# EAGLE design GhelbereuEduardGabrielPROIECT2026 (EAGLE 9.7.0)
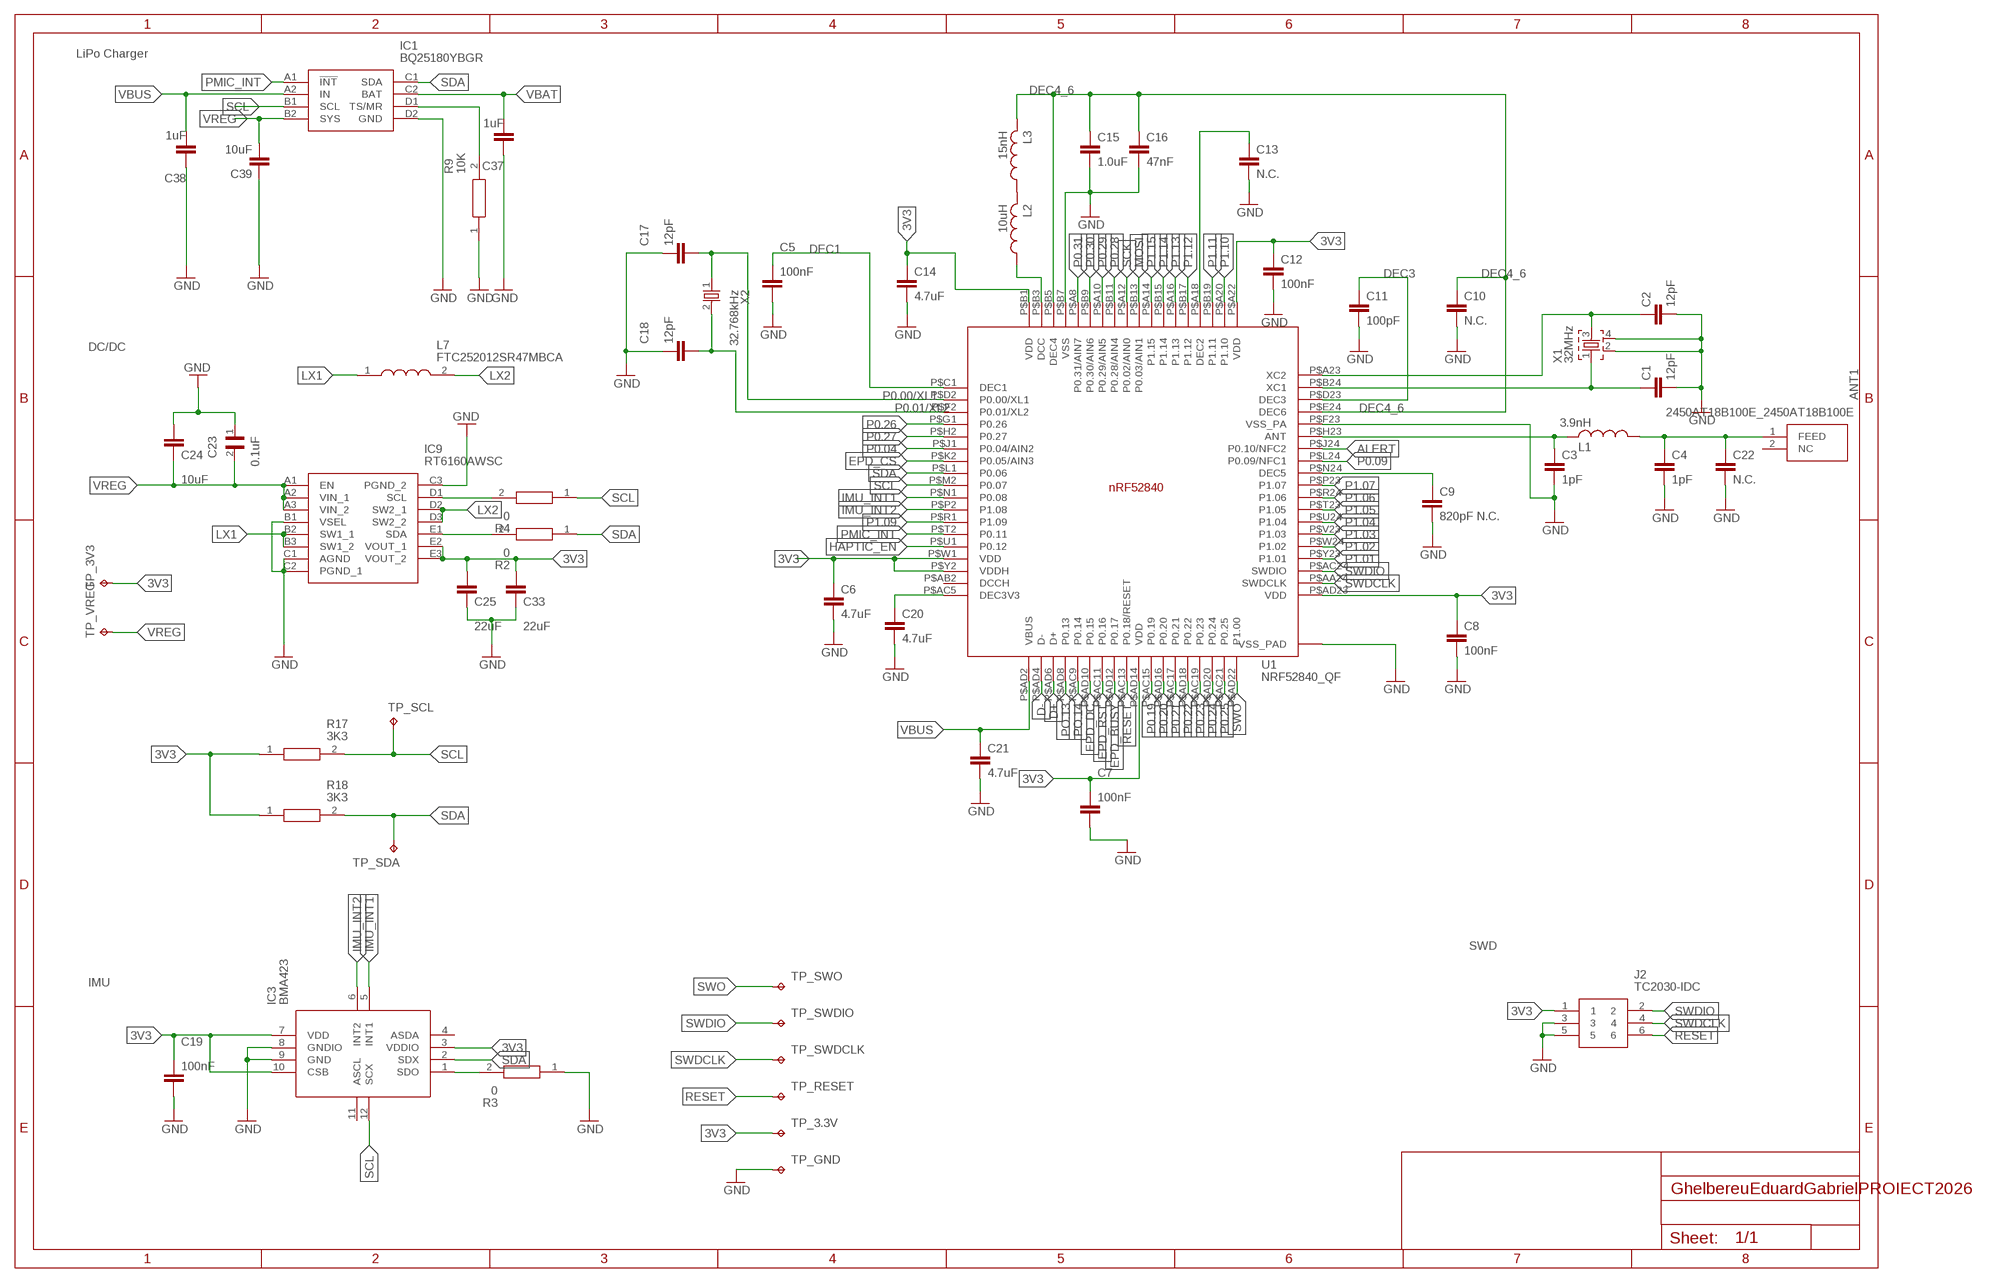
[diagram p0: schematic, sheet 1, part 1 of 2]
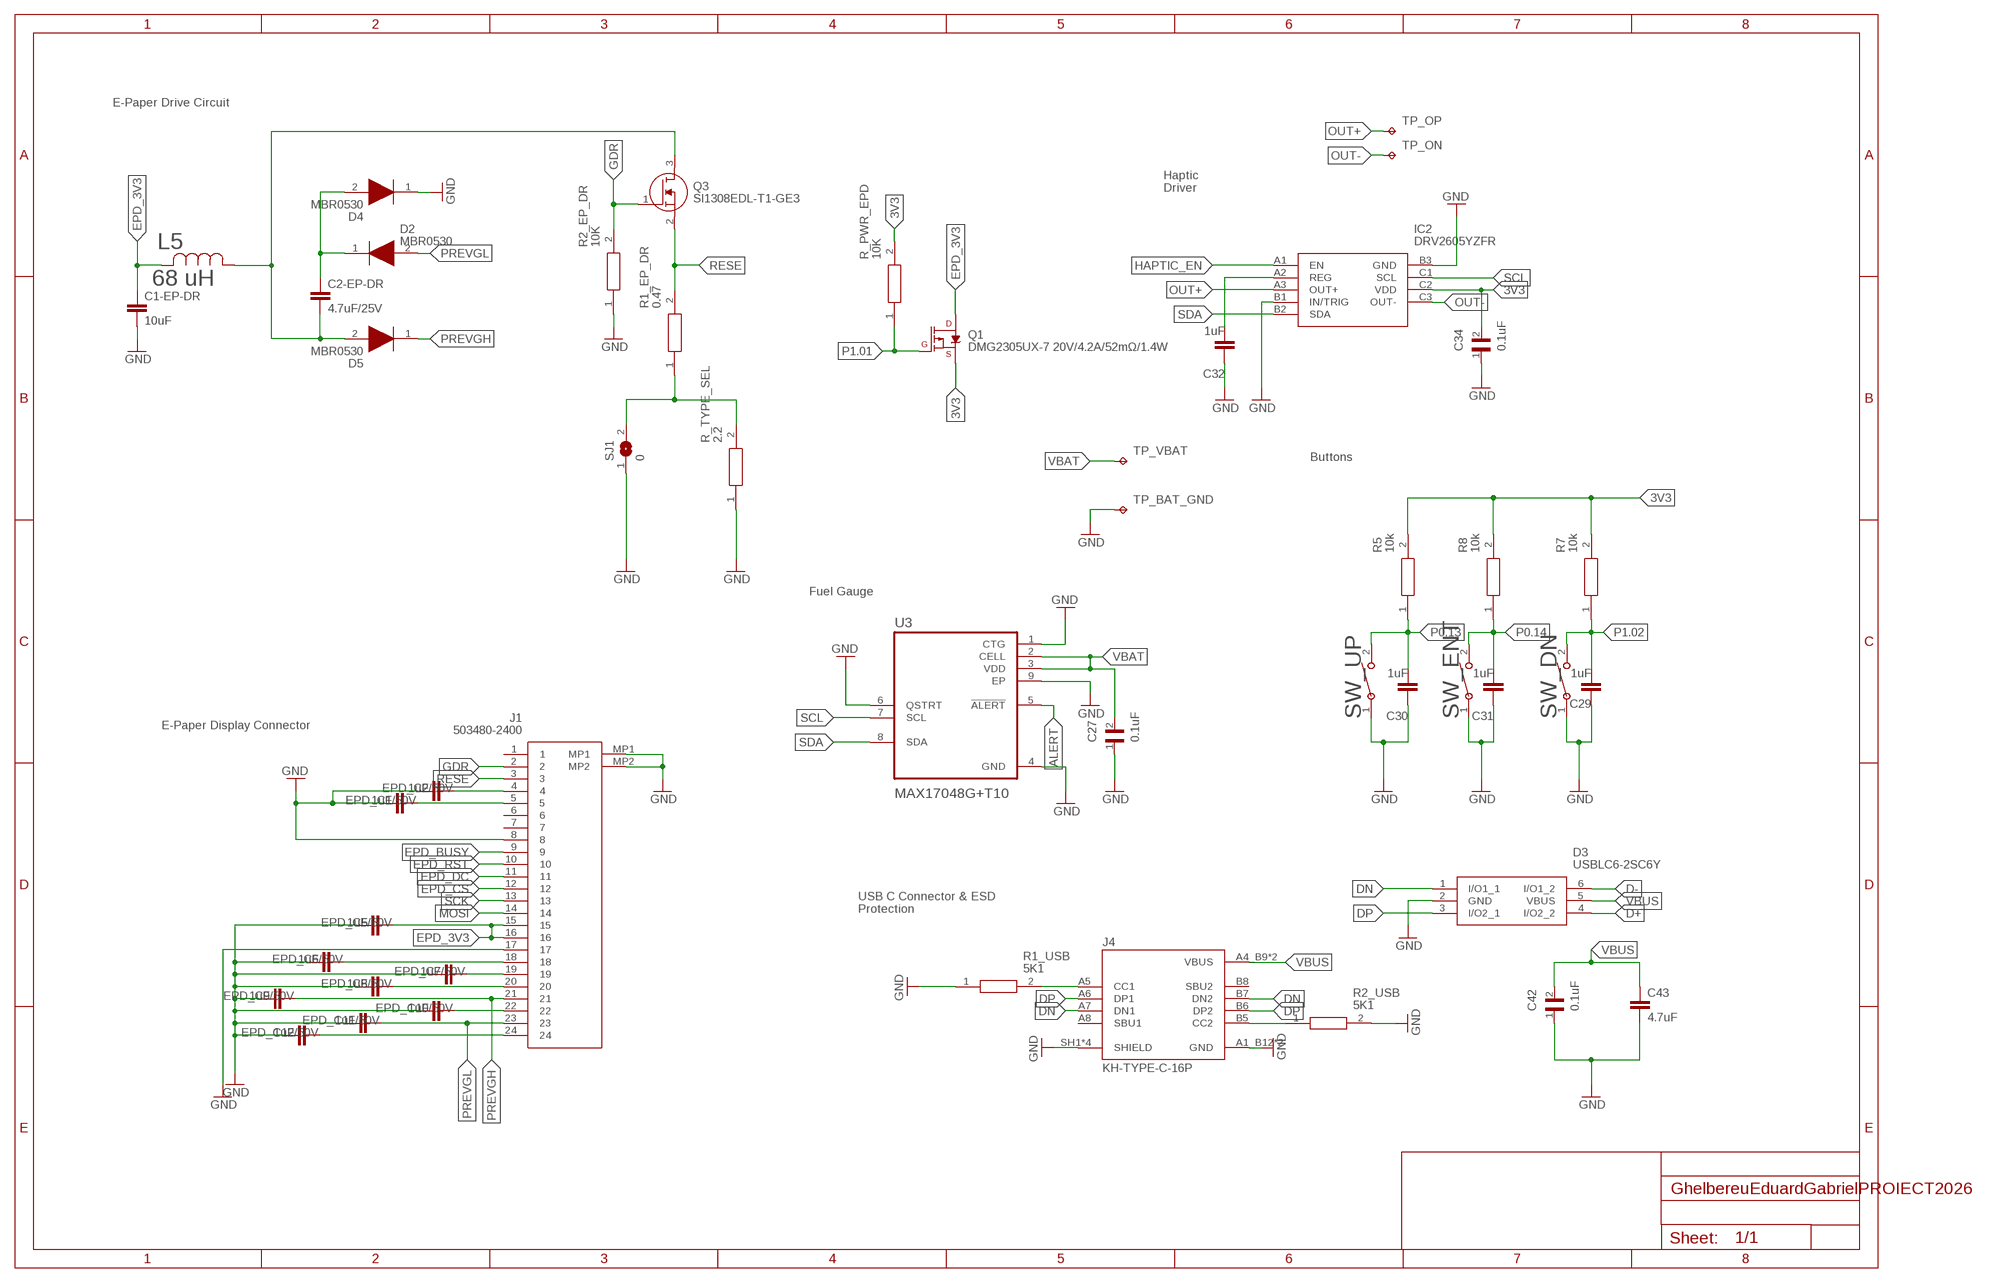
[diagram p1: schematic, sheet 1, part 2 of 2]

## Parts
ANT1  2450AT18B100E_2450AT18B100E  [2450AT18B100E_ANTC3216X140N]
C1  12pF  NORDIC_NRF_3_CAPACITOR_0201_L  [NORDIC_NRF_3_RESC0201_L]
C1-EP-DR  10uF  PERFECT_0402_CAP_0402  [PERFECT_0402_0402]
C2  12pF  NORDIC_NRF_3_CAPACITOR_0201_L  [NORDIC_NRF_3_RESC0201_L]
C2-EP-DR  4.7uF/25V  PERFECT_0402_CAP_0402  [PERFECT_0402_0402]
C3  1pF  NORDIC_NRF_3_CAPACITOR_0201_L  [NORDIC_NRF_3_RESC0201_L]
C4  1pF  NORDIC_NRF_3_CAPACITOR_0201_L  [NORDIC_NRF_3_RESC0201_L]
C5  100nF  NORDIC_NRF_3_CAPACITOR_0201_L  [NORDIC_NRF_3_RESC0201_L]
C6  4.7uF  PERFECT_0402_CAP_0402  [PERFECT_0402_0402]
C7  100nF  NORDIC_NRF_3_CAPACITOR_0201_L  [NORDIC_NRF_3_RESC0201_L]
C8  100nF  NORDIC_NRF_3_CAPACITOR_0201_L  [NORDIC_NRF_3_RESC0201_L]
C9  820pF N.C.  NORDIC_NRF_3_CAPACITOR_0201_L  [NORDIC_NRF_3_RESC0201_L]
C10  N.C.  NORDIC_NRF_3_CAPACITOR_0201_L  [NORDIC_NRF_3_RESC0201_L]
C11  100pF  NORDIC_NRF_3_CAPACITOR_0201_L  [NORDIC_NRF_3_RESC0201_L]
C12  100nF  NORDIC_NRF_3_CAPACITOR_0201_L  [NORDIC_NRF_3_RESC0201_L]
C13  N.C.  NORDIC_NRF_3_CAPACITOR_0201_L  [NORDIC_NRF_3_RESC0201_L]
C14  4.7uF  PERFECT_0402_CAP_0402  [PERFECT_0402_0402]
C15  1.0uF  PERFECT_0402_CAP_0402  [PERFECT_0402_0402]
C16  47nF  NORDIC_NRF_3_CAPACITOR_0201_L  [NORDIC_NRF_3_RESC0201_L]
C17  12pF  NORDIC_NRF_3_CAPACITOR_0201_L  [NORDIC_NRF_3_RESC0201_L]
C18  12pF  NORDIC_NRF_3_CAPACITOR_0201_L  [NORDIC_NRF_3_RESC0201_L]
C19  100nF  NORDIC_NRF_3_CAPACITOR_0201_L  [NORDIC_NRF_3_RESC0201_L]
C20  4.7uF  PERFECT_0402_CAP_0402  [PERFECT_0402_0402]
C21  4.7uF  PERFECT_0402_CAP_0402  [PERFECT_0402_0402]
C22  N.C.  NORDIC_NRF_3_CAPACITOR_0201_L  [NORDIC_NRF_3_RESC0201_L]
C23  0.1uF  GRM011R60J152KE01L_1_GRM011R60J152KE01L  [GRM011R60J152KE01L_1_0201]
C24  10uF  PERFECT_0402_CAP_0402  [PERFECT_0402_0402]
C25  22uF  PERFECT_0402_CAP_0402  [PERFECT_0402_0402]
C27  0.1uF  GRM011R60J152KE01L_2_GRM011R60J152KE01L  [GRM011R60J152KE01L_2_CAPC0201X13N]
C29  1uF  NORDIC_NRF_3_CAPACITOR_0402_L  [NORDIC_NRF_3_RESC0402_L]
C30  1uF  NORDIC_NRF_3_CAPACITOR_0402_L  [NORDIC_NRF_3_RESC0402_L]
C31  1uF  NORDIC_NRF_3_CAPACITOR_0402_L  [NORDIC_NRF_3_RESC0402_L]
C32  1uF  NORDIC_NRF_3_CAPACITOR_0402_L  [NORDIC_NRF_3_RESC0402_L]
C33  22uF  PERFECT_0402_CAP_0402  [PERFECT_0402_0402]
C34  0.1uF  GRM011R60J152KE01L_2_GRM011R60J152KE01L  [GRM011R60J152KE01L_2_CAPC0201X13N]
C37  1uF  NORDIC_NRF_3_CAPACITOR_0402_L  [NORDIC_NRF_3_RESC0402_L]
C38  1uF  NORDIC_NRF_3_CAPACITOR_0402_L  [NORDIC_NRF_3_RESC0402_L]
C39  10uF  NORDIC_NRF_3_CAPACITOR_0402_L  [NORDIC_NRF_3_RESC0402_L]
C42  0.1uF  GRM011R60J152KE01L_2_GRM011R60J152KE01L  [GRM011R60J152KE01L_2_CAPC0201X13N]
C43  4.7uF  PERFECT_0402_CAP_0402  [PERFECT_0402_0402]
D2  MBR0530  ESP32_C6_LIBRARY_5_MBR0530  [ESP32_C6_LIBRARY_5_SOD3716X135N]
D3  USBLC6-2SC6Y  ESP32_C6_LIBRARY_3_USBLC6-2SC6Y  [ESP32_C6_LIBRARY_3_SOT95P280X145-6N]
D4  MBR0530  ESP32_C6_LIBRARY_5_MBR0530  [ESP32_C6_LIBRARY_5_SOD3716X135N]
D5  MBR0530  ESP32_C6_LIBRARY_5_MBR0530  [ESP32_C6_LIBRARY_5_SOD3716X135N]
EPD_C1  1uF/50V  PERFECT_0402_CAP_0402  [PERFECT_0402_0402]
EPD_C2  1uF/50V  PERFECT_0402_CAP_0402  [PERFECT_0402_0402]
EPD_C5  1uF/50V  PERFECT_0402_CAP_0402  [PERFECT_0402_0402]
EPD_C6  1uF/50V  PERFECT_0402_CAP_0402  [PERFECT_0402_0402]
EPD_C7  1uF/50V  PERFECT_0402_CAP_0402  [PERFECT_0402_0402]
EPD_C8  1uF/50V  PERFECT_0402_CAP_0402  [PERFECT_0402_0402]
EPD_C9  1uF/50V  PERFECT_0402_CAP_0402  [PERFECT_0402_0402]
EPD_C10  1uF/50V  PERFECT_0402_CAP_0402  [PERFECT_0402_0402]
EPD_C11  1uF/50V  PERFECT_0402_CAP_0402  [PERFECT_0402_0402]
EPD_C12  1uF/50V  PERFECT_0402_CAP_0402  [PERFECT_0402_0402]
IC1  BQ25180YBGR  BQ25180YBGR_BQ25180YBGR  [BQ25180YBGR_BGA8C40P2X4_100X155X50]
IC2  DRV2605YZFR  DRV2605YZFR_DRV2605YZFR  [DRV2605YZFR_BGA9C50P3X3_144X144X62]
IC3  BMA423  BMA423_BMA423  [BMA423_BMA423]
IC9  RT6160AWSC  RT6160AWSC_RT6160AWSC  [RT6160AWSC_BGA15C40P3X5_140X230X60]
J1  503480-2400  503480-2400_503480-2400  [503480-2400_5034802400]
J2  TC2030-IDC  TC2030-IDC_TC2030-IDC  [TC2030-IDC_TC2030IDC]
J4  KH-TYPE-C-16P  KH-TYPE-C-16P_KH-TYPE-C-16P  [KH-TYPE-C-16P_KINGHELM_KH-TYPE-C-16P]
L1  3.9nH  NORDIC_NRF_2_INDUCTOR_0402_L  [NORDIC_NRF_2_RESC0402_L]
L2  10uH  NORDIC_NRF_2_INDUCTOR_0402_L  [NORDIC_NRF_2_RESC0402_L]
L3  15nH  NORDIC_NRF_2_INDUCTOR_0402_L  [NORDIC_NRF_2_RESC0402_L]
L5  68 uH  ESP32_C6_LIBRARY_2_744043680IND_4828-WE-TPC_WRE  [ESP32_C6_LIBRARY_2_IND_4828-WE-TPC_WRE]
L7  FTC252012SR47MBCA  MLP2016SR47MT0S1_FTC252012SR47MBCA  [MLP2016SR47MT0S1_INDC2016X100N]
Q1  DMG2305UX-7 20V/4.2A/52mΩ/1.4W  ESP32_C6_LIBRARY_4_ESP32_WROVER_SPARKFUN-DISCRETESEMI_MOSFET_PCH-DMG2305UX-7  [ESP32_C6_LIBRARY_4_ESP32_C6_LIBRARY_4_ESP32_C6_LIBRARY_4_ESP32_C6_LIBRARY_4_ESP32_WROVER_SPARKFUN-DISCRETESEMI_SOT23-3]
Q3  SI1308EDL-T1-GE3  ESP32_C6_LIBRARY_6_SI1308EDL-T1-GE3  [ESP32_C6_LIBRARY_6_SOT65P210X110-3N]
R1_EP_DR  0.47  ERA-1AEB3401C_CPF0201D7K68C1  [ERA-1AEB3401C_0201]
R1_USB  5K1  CPF0201D7K68C1_CPF0201D7K68C1  [CPF0201D7K68C1_0201]
R2  0  ERA-1AEB3401C_CPF0201D7K68C1  [ERA-1AEB3401C_0201]
R2_EP_DR  10K  ERA-1AEB3401C_CPF0201D7K68C1  [ERA-1AEB3401C_0201]
R2_USB  5K1  CPF0201D7K68C1_CPF0201D7K68C1  [CPF0201D7K68C1_0201]
R3  0  CPF0201D7K68C1_CPF0201D7K68C1  [CPF0201D7K68C1_0201]
R4  0  ERA-1AEB3401C_CPF0201D7K68C1  [ERA-1AEB3401C_0201]
R5  10k  CPF0201D7K68C1_CPF0201D7K68C1  [CPF0201D7K68C1_0201]
R7  10k  CPF0201D7K68C1_CPF0201D7K68C1  [CPF0201D7K68C1_0201]
R8  10k  CPF0201D7K68C1_CPF0201D7K68C1  [CPF0201D7K68C1_0201]
R9  10K  ERA-1AEB3401C_CPF0201D7K68C1  [ERA-1AEB3401C_0201]
R17  3K3  ERA-1AEB3401C_CPF0201D7K68C1  [ERA-1AEB3401C_0201]
R18  3K3  ERA-1AEB3401C_CPF0201D7K68C1  [ERA-1AEB3401C_0201]
R_PWR_EPD  10K  CPF0201D7K68C1_CPF0201D7K68C1  [CPF0201D7K68C1_0201]
R_TYPE_SEL  2.2  ERA-1AEB3401C_CPF0201D7K68C1  [ERA-1AEB3401C_0201]
SJ1  0  ESP32_C6_LIBRARY_7_JUMPER_SJ  [ESP32_C6_LIBRARY_7_JUMPER_SJ]
SW_DN  2025-10-22_07-23-44_LIBRARY_EVP-AKE31ASW_EVP-AKE31A_PAN  [2025-10-22_07-23-44_LIBRARY_SW_EVP-AKE31A_PAN]
SW_ENT  2025-10-22_07-23-44_LIBRARY_EVP-AKE31ASW_EVP-AKE31A_PAN  [2025-10-22_07-23-44_LIBRARY_SW_EVP-AKE31A_PAN]
SW_UP  2025-10-22_07-23-44_LIBRARY_EVP-AKE31ASW_EVP-AKE31A_PAN  [2025-10-22_07-23-44_LIBRARY_SW_EVP-AKE31A_PAN]
TP_3.3V  HECTOR_WATCH_1_TPTP20R  [HECTOR_WATCH_1_TP20R]
TP_3V3  HECTOR_WATCH_1_TPTP20R  [HECTOR_WATCH_1_TP20R]
TP_BAT_GND  HECTOR_WATCH_1_TPTP20R  [HECTOR_WATCH_1_TP20R]
TP_GND  HECTOR_WATCH_1_TPTP20R  [HECTOR_WATCH_1_TP20R]
TP_ON  HECTOR_WATCH_1_TPTP20R  [HECTOR_WATCH_1_TP20R]
TP_OP  HECTOR_WATCH_1_TPTP20R  [HECTOR_WATCH_1_TP20R]
TP_RESET  HECTOR_WATCH_1_TPTP20R  [HECTOR_WATCH_1_TP20R]
TP_SCL  HECTOR_WATCH_1_TPTP20R  [HECTOR_WATCH_1_TP20R]
TP_SDA  HECTOR_WATCH_1_TPTP20R  [HECTOR_WATCH_1_TP20R]
TP_SWDCLK  HECTOR_WATCH_1_TPTP20R  [HECTOR_WATCH_1_TP20R]
TP_SWDIO  HECTOR_WATCH_1_TPTP20R  [HECTOR_WATCH_1_TP20R]
TP_SWO  HECTOR_WATCH_1_TPTP20R  [HECTOR_WATCH_1_TP20R]
TP_VBAT  HECTOR_WATCH_1_TPTP20R  [HECTOR_WATCH_1_TP20R]
TP_VREG  HECTOR_WATCH_1_TPTP20R  [HECTOR_WATCH_1_TP20R]
U1  NRF52840_QF  NORDIC_NRF_4_NRF52840_QF  [NORDIC_NRF_4_AQFN50P700X700X85_HS-74N]
U3  MAX17048G+T10  ESP32_C6_LIBRARY_MAX17048G+T10  [ESP32_C6_LIBRARY_SON50P200X200X80-9N]
X1  32MHz  NORDIC_NRF_XTAL_32MHZ  [NORDIC_NRF_BT-XTAL_2016_N]
X2  32.768kHz  NORDIC_NRF_1_XTAL_32KHZ  [NORDIC_NRF_1_XTAL_3215_N]

## Nets
3V3: C6.1 C7.1 C8.1 C12.1 C14.1 C19.1 C25.1 C33.1 C34.2 IC2.C2(VDD) IC3.3(VDDIO) IC3.7(VDD) IC3.10(CSB) IC9.E2(VOUT_1) IC9.E3(VOUT_2) J2.1 Q1.2(S) R5.2 R7.2 R8.2 R17.1 R18.1 R_PWR_EPD.2 TP_3.3V.TP TP_3V3.TP U1.P$A22(VDD) U1.P$AD14(VDD) U1.P$AD23(VDD) U1.P$B1(VDD) U1.P$W1(VDD) U1.P$Y2(VDDH)
ALERT: U1.P$J24(P0.10/NFC2) U3.5(!ALERT)
D+: D3.4(I/O2_2) U1.P$AD6(D+)
D-: D3.6(I/O1_2) U1.P$AD4(D-)
DEC1: C5.1 U1.P$C1(DEC1)
DEC3: C11.1 U1.P$D23(DEC3)
DEC4_6: C10.1 C15.1 C16.1 L3.2 U1.P$B5(DEC4) U1.P$E24(DEC6)
DN: D3.1(I/O1_1) J4.A7(DN1) J4.B7(DN2)
DP: D3.3(I/O2_1) J4.A6(DP1) J4.B6(DP2)
EPD_3V3: C1-EP-DR.1 EPD_C5.2 J1.15 J1.16 L5.2 Q1.3(D)
EPD_BUSY: J1.9 U1.P$AD12(P0.17)
EPD_CS: J1.12 U1.P$K2(P0.05/AIN3)
EPD_DC: J1.11 U1.P$AD10(P0.15)
EPD_RST: J1.10 U1.P$AC11(P0.16)
GDR: J1.2 Q3.1(G) R2_EP_DR.2
GND: C1-EP-DR.2 C1.2 C2.2 C3.2 C4.2 C5.2 C6.2 C7.2 C8.2 C9.2 C10.2 C11.2 C12.2 C13.2 C14.2 C15.2 C16.2 C17.1 C18.1 C19.2 C20.2 C21.2 C22.2 C23.1 C24.1 C25.2 C27.1 C29.1 C30.1 C31.1 C32.1 C33.2 C34.1 C37.1 C38.1 C39.1 C42.1 C43.2 D3.2(GND) D4.1(K) EPD_C1.1 EPD_C2.1 EPD_C5.1 EPD_C6.1 EPD_C7.1 EPD_C8.1 EPD_C9.1 EPD_C10.1 EPD_C11.1 EPD_C12.1 IC1.D2(GND) IC2.B1(IN/TRIG) IC2.B3(GND) IC3.8(GNDIO) IC3.9(GND) IC9.B1(VSEL) IC9.C1(AGND) IC9.C2(PGND_1) IC9.C3(PGND_2) J1.8 J1.17 J1.MP1 J1.MP2 J2.3 J2.5 J4.A1_B12(GND) J4.A12_B1(GND) J4.SH1(SHIELD) J4.SH2(SHIELD) J4.SH3(SHIELD) J4.SH4(SHIELD) R1_USB.1 R2_EP_DR.1 R2_USB.2 R3.1 R9.1 R_TYPE_SEL.1 SJ1.1 SW_DN.1 SW_ENT.1 SW_UP.1 TP_BAT_GND.TP TP_GND.TP U1.P$74(VSS_PAD) U1.P$75(VSS_PAD) U1.P$76(VSS_PAD) U1.P$77(VSS_PAD) U1.P$78(VSS_PAD) U1.P$79(VSS_PAD) U1.P$80(VSS_PAD) U1.P$81(VSS_PAD) U1.P$82(VSS_PAD) U1.P$83(VSS_PAD) U1.P$84(VSS_PAD) U1.P$85(VSS_PAD) U1.P$86(VSS_PAD) U1.P$87(VSS_PAD) U1.P$88(VSS_PAD) U1.P$89(VSS_PAD) U1.P$90(VSS_PAD) U1.P$B7(VSS) U1.P$F23(VSS_PA) U3.1(CTG) U3.4(GND) U3.6(QSTRT) U3.9(EP) X1.2 X1.4
HAPTIC_EN: IC2.A1(EN) U1.P$U1(P0.12)
IMU_INT1: IC3.5(INT1) U1.P$N1(P0.08)
IMU_INT2: IC3.6(INT2) U1.P$P2(P1.08)
LX1: IC9.B2(SW1_1) IC9.B3(SW1_2) L7.1
LX2: IC9.D2(SW2_1) IC9.D3(SW2_2) L7.2
MOSI: J1.14 U1.P$B13(P0.03/AIN1)
N$1: ANT1.1(FEED) C4.1 C22.1 L1.2
N$2: IC9.D1(SCL) R4.2
N$3: IC1.D1(TS/MR) R9.2
N$4: C2.1 U1.P$A23(XC2) X1.3
N$5: IC9.E1(SDA) R2.2
N$6: J4.A5(CC1) R1_USB.2
N$7: L2.2 L3.1
N$8: IC3.1(SDO) R3.2
N$9: C1.1 U1.P$B24(XC1) X1.1
N$10: C3.1 L1.1 U1.P$H23(ANT)
N$11: C32.2 IC2.A2(REG)
N$13: C2-EP-DR.1 D2.1(K) D4.2(A)
N$14: C9.1 U1.P$N24(DEC5)
N$15: R1_EP_DR.1 R_TYPE_SEL.2 SJ1.2
N$16: C2-EP-DR.2 D5.2(A) L5.1 Q3.3(D)
N$17: EPD_C2.2 J1.4
N$18: EPD_C1.2 J1.5
N$20: C20.1 U1.P$AC5(DEC3V3)
N$22: L2.1 U1.P$B3(DCC)
N$26: J4.B5(CC2) R2_USB.1
N$30: EPD_C6.2 J1.18
N$31: EPD_C7.2 J1.19
N$32: EPD_C8.2 J1.20
N$34: EPD_C10.2 J1.22
N$35: C13.1 U1.P$A18(DEC2)
N$37: EPD_C12.2 J1.24
OUT+: IC2.A3(OUT+) TP_OP.TP
OUT-: IC2.C3(OUT-) TP_ON.TP
P0.00/XL1: C17.2 U1.P$D2(P0.00/XL1) X2.1
P0.01/XL2: C18.2 U1.P$F2(P0.01/XL2) X2.2
P0.04: U1.P$J1(P0.04/AIN2)
P0.09: U1.P$L24(P0.09/NFC1)
P0.13: C30.2 R5.1 SW_UP.2
P0.14: C31.2 R8.1 SW_ENT.2
P0.19: U1.P$AC15(P0.19)
P0.20: U1.P$AD16(P0.20)
P0.21: U1.P$AC17(P0.21)
P0.22: U1.P$AD18(P0.22)
P0.23: U1.P$AC19(P0.23)
P0.24: U1.P$AD20(P0.24)
P0.25: U1.P$AC21(P0.25)
P0.26: U1.P$G1(P0.26)
P0.27: U1.P$H2(P0.27)
P0.28: U1.P$B11(P0.28/AIN4)
P0.29: U1.P$A10(P0.29/AIN5)
P0.30: U1.P$B9(P0.30/AIN6)
P0.31: U1.P$A8(P0.31/AIN7)
P1.01: Q1.1(G) R_PWR_EPD.1 U1.P$Y23(P1.01)
P1.02: C29.2 R7.1 SW_DN.2 U1.P$W24(P1.02)
P1.03: U1.P$V23(P1.03)
P1.04: U1.P$U24(P1.04)
P1.05: U1.P$T23(P1.05)
P1.06: U1.P$R24(P1.06)
P1.07: U1.P$P23(P1.07)
P1.09: U1.P$R1(P1.09)
P1.10: U1.P$A20(P1.10)
P1.11: U1.P$B19(P1.11)
P1.12: U1.P$B17(P1.12)
P1.13: U1.P$A16(P1.13)
P1.14: U1.P$B15(P1.14)
P1.15: U1.P$A14(P1.15)
PMIC_INT: IC1.A1(!INT) U1.P$T2(P0.11)
PO.13: U1.P$AD8(P0.13)
PO.14: U1.P$AC9(P0.14)
PREVGH: D5.1(K) EPD_C9.2 J1.21
PREVGL: D2.2(A) EPD_C11.2 J1.23
RESE: J1.3 Q3.2(S) R1_EP_DR.2
RESET: J2.6 TP_RESET.TP U1.P$AC13(P0.18/RESET)
SCK: J1.13 U1.P$A12(P0.02/AIN0)
SCL: IC1.B1(SCL) IC2.C1(SCL) IC3.12(SCX) R4.1 R17.2 TP_SCL.TP U1.P$M2(P0.07) U3.7(SCL)
SDA: IC1.C1(SDA) IC2.B2(SDA) IC3.2(SDX) R2.1 R18.2 TP_SDA.TP U1.P$L1(P0.06) U3.8(SDA)
SWDCLK: J2.4 TP_SWDCLK.TP U1.P$AA24(SWDCLK)
SWDIO: J2.2 TP_SWDIO.TP U1.P$AC24(SWDIO)
SWO: TP_SWO.TP U1.P$AD22(P1.00)
VBAT: C27.2 C37.2 IC1.C2(BAT) TP_VBAT.TP U3.2(CELL) U3.3(VDD)
VBUS: C21.1 C38.2 C42.2 C43.1 D3.5(VBUS) IC1.A2(IN) J4.A4_B9(VBUS) J4.A9_B4(VBUS) U1.P$AD2(VBUS)
VREG: C23.2 C24.2 C39.2 IC1.B2(SYS) IC9.A1(EN) IC9.A2(VIN_1) IC9.A3(VIN_2) TP_VREG.TP
Unconnected: ANT1.2(NC) IC3.4(ASDA) IC3.11(ASCL) J1.1 J1.6 J1.7 J4.A8(SBU1) J4.B8(SBU2) U1.P$AB2(DCCH)

## Notes on the sheet
- LiPo Charger
- DC/DC
- SWD
- IMU
- E-Paper Drive Circuit
- Haptic
  Driver
- Buttons
- Fuel Gauge
- E-Paper Display Connector
- USB C Connector & ESD
  Protection

## Library data of the parts
ANT1 = InkTime_v5.lbr:2450AT18B100E_2450AT18B100E: Antennas 2.45GHz ANTENNA Source: Datasheet <https://www.johansontechnology.com/datasheets/2450AT18B100/2450AT18B100.pdf>
C1-C5 C7-C13 C16-C19 C22 C29-C32 C37-C39 = InkTime_v5.lbr:NORDIC_NRF_3_CAPACITOR: Generic chip capacitor
C1-EP-DR C2-EP-DR C6 C14 C15 C20 C21 C24 C25 C33 C43 EPD_C1 EPD_C2 EPD_C5-EPD_C12 = InkTime_v5.lbr:PERFECT_0402_CAP_0402: 0402 (1005 Metric) Nick Garner - TeleSense
C23 = InkTime_v5.lbr:GRM011R60J152KE01L_1_GRM011R60J152KE01L: Check availability <https://pricing.snapeda.com/parts/GRM011R60J152KE01L/Murata/view-part?ref=eda>
C27 C34 C42 = InkTime_v5.lbr:GRM011R60J152KE01L_2_GRM011R60J152KE01L: Check availability <https://pricing.snapeda.com/parts/GRM011R60J152KE01L/Murata/view-part?ref=eda>
D2 D4 D5 = InkTime_v5.lbr:ESP32_C6_LIBRARY_5_MBR0530: ON SEMICONDUCTOR - MBR0530 - DIODE, SCHOTTKY, 0.5A, 30V, SOD-123 Source: Datasheet <http://www.onsemi.com/pub/Collateral/MBR0530T1-D.PDF> Check availability <https://pricing.snapeda.com/parts/MBR0530/ON%20Semiconductor/view-part?ref=eda>
D3 = InkTime_v5.lbr:ESP32_C6_LIBRARY_3_USBLC6-2SC6Y: Low Cap. ESD Protection Auto SOT-23-6 STMicroelectronics USBLC6-2SC6Y, Dual Uni-Directional TVS Diode Array, 6-Pin SOT-23 Source: Datasheet <https://componentsearchengine.com/Datasheets/1/USBLC6-2SC6Y.pdf> Check availability <https://pricing.snapeda.com/parts/USBLC6-2SC6Y/STMicroelectronics/view-part?ref=eda>
IC1 = InkTime_v5.lbr:BQ25180YBGR_BQ25180YBGR: Charger IC Lithium Ion/Polymer, Lithium Iron Phosphate 8-DSBGA (1.6x1.1) Source: Datasheet <https://www.ti.com/lit/ds/symlink/bq25180.pdf?ts=1650264094470&ref_url=https%3A%2F%2Fwww.ti.com%2Fproduct%2FBQ25180>
IC2 = InkTime_v5.lbr:DRV2605YZFR_DRV2605YZFR: Haptic Driver for ERM/LRA with Built-In Library and Smart Loop Architecture Source: Datasheet <http://www.ti.com/lit/gpn/drv2605>
IC3 = InkTime_v5.lbr:BMA423_BMA423: Accelerometers Triaxial low-g 12bit Acceleration Sensor Source: Datasheet <https://www.mouser.com/datasheet/2/783/BST-BMA423-DS000-1509600.pdf>
IC9 = InkTime_v5.lbr:RT6160AWSC_RT6160AWSC: Buck-Boost Regulator Positive Output Step-Up/Step-Down I2C DC-DC Controller IC 15-WL-CSP (BSC) (1.4x2.3) Source: Datasheet <https://www.richtek.com/SaveDownload.aspx?specid=RT6160A>
J1 = InkTime_v5.lbr:503480-2400_503480-2400: FFC & FPC Connectors 0.5mm FPC RA SMT Dual Contact 24Ckt Source: Datasheet <https://componentsearchengine.com/Datasheets/1/503480-2400.pdf>
J2 = InkTime_v5.lbr:TC2030-IDC_TC2030-IDC: CABLE ADAPTER 6 POS Source: Datasheet <https://datasheet.datasheetarchive.com/originals/distributors/Datasheets_SAMA/62bc384e093448baaaa63dbd0b9d8707.pdf>
J4 = InkTime_v5.lbr:KH-TYPE-C-16P_KH-TYPE-C-16P: Check availability <https://pricing.snapeda.com/parts/KH-TYPE-C-16P/kinghelm/view-part?ref=eda>
L1-L3 = InkTime_v5.lbr:NORDIC_NRF_2_INDUCTOR: Generic chip inductor
L5 = InkTime_v5.lbr:ESP32_C6_LIBRARY_2_744043680
L7 = InkTime_v5.lbr:MLP2016SR47MT0S1_FTC252012SR47MBCA: SMD / SMT Inductors (Coils), L=0.47?H, L x W x T : Source: Datasheet <https://product.tdk.com/system/files/dam/doc/product/inductor/inductor/smd/catalog/inductor_commercial_power_mlp2016_en.pdf>
Q1 = InkTime_v5.lbr:ESP32_C6_LIBRARY_4_ESP32_WROVER_SPARKFUN-DISCRETESEMI_MOSFET_PCH: P-channel MOSFETs Voltage controlled devices that allow control of high current outputs. SparkFun Products: SparkFun ESP32 Thing <https://www.sparkfun.com/products/13907> SparkFun ESP8266 Thing <https://www.sparkfun.com/products/13231> SparkFun Pi Servo HAT V2 <https://www.sparkfun.com/products/15316> DMG2305UX-7 (20V/4.2A/SOT23-3)
Q3 = InkTime_v5.lbr:ESP32_C6_LIBRARY_6_SI1308EDL-T1-GE3: MOSFET N-Ch 30V 1.5A TrenchFET SC70 Vishay Si1308EDL-T1-GE3 N-channel MOSFET Transistor, 1.5 A, 30 V, 3-Pin SC-70 Source: Datasheet <https://componentsearchengine.com/Datasheets/1/SI1308EDL-T1-GE3.pdf> Check availability <https://pricing.snapeda.com/parts/SI1308EDL-T1-GE3/Vishay%20Siliconix/view-part?ref=eda>
R1_EP_DR R2 R2_EP_DR R4 R9 R17 R18 R_TYPE_SEL = InkTime_v5.lbr:ERA-1AEB3401C_CPF0201D7K68C1: 7.68k 0201 Thin Film Surface Mount Fixed Resistor +/-0.5% 0.031W CPF0201D7K68C1 Source: Datasheet <http://www.te.com/commerce/DocumentDelivery/DDEController?Action=showdoc&DocId=Data Sheet1773200-1ApdfEnglishENG_DS_1773200-1_A.pdf4-2176215-6>
R1_USB R2_USB R3 R5 R7 R8 R_PWR_EPD = InkTime_v5.lbr:CPF0201D7K68C1_CPF0201D7K68C1: 7.68k 0201 Thin Film Surface Mount Fixed Resistor +/-0.5% 0.031W CPF0201D7K68C1 Source: Datasheet <http://www.te.com/commerce/DocumentDelivery/DDEController?Action=showdoc&DocId=Data Sheet1773200-1ApdfEnglishENG_DS_1773200-1_A.pdf4-2176215-6>
SJ1 = InkTime_v5.lbr:ESP32_C6_LIBRARY_7_JUMPER_SJ: SMD solder JUMPER
SW_DN SW_ENT SW_UP = InkTime_v5.lbr:2025-10-22_07-23-44_LIBRARY_EVP-AKE31A
TP_3.3V TP_3V3 TP_BAT_GND TP_GND TP_ON TP_OP TP_RESET TP_SCL TP_SDA TP_SWDCLK TP_SWDIO TP_SWO TP_VBAT TP_VREG = InkTime_v5.lbr:HECTOR_WATCH_1_TP: Test pad
U1 = InkTime_v5.lbr:NORDIC_NRF_4_NRF52840_QF: nRF52840 Features Advanced Single chip 2.4 GHz multi-protocol SoC 32-bit ARM Cortex-M4F Processor 1.7v to 5.5v operation 1MB flash + 256kB RAM Bluetooth 5 support for long range and high throughput 802.15.4 radio support On-chip NFC PPI –Programmable Peripheral Interconnect Automated power management system with automatic power management of each peripheral Configurable I/O mapping for analog and digital I/O 48 x GPIO 1 x QSPI 4 x Master/Slave SPI 2 x Two-wire interface (I²C) I²S interface 2 x UART 4 x PWM USB 2.0 controller ARM TrustZone CryptoCell-310 Cryptographic and security module AES 128-bit ECB/CCM/AAR hardware accelerator Digital microphone interface (PDM) Quadrature decoder 12-bit ADC Low power comparator On-chip 50Ω balun On-air compatible with nRF52, nRF51 and nRF24 Series Applications Advanced high performance wearables Wearables for secure payments Virtual Reality/Augmented Reality systems Smart Home sensor networks Smart city sensor networks High performance HID controllers Internet of Things (IoT) sensor networks Smart door locks Smart lighting networks Connected white goods
U3 = InkTime_v5.lbr:ESP32_C6_LIBRARY_MAX17048G+T10: Check availability <https://pricing.snapeda.com/parts/MAX17048G%2BT10/Analog%20Devices/view-part?ref=eda>
X1 = InkTime_v5.lbr:NORDIC_NRF_XTAL_32MHZ
X2 = InkTime_v5.lbr:NORDIC_NRF_1_XTAL_32KHZ

## Board
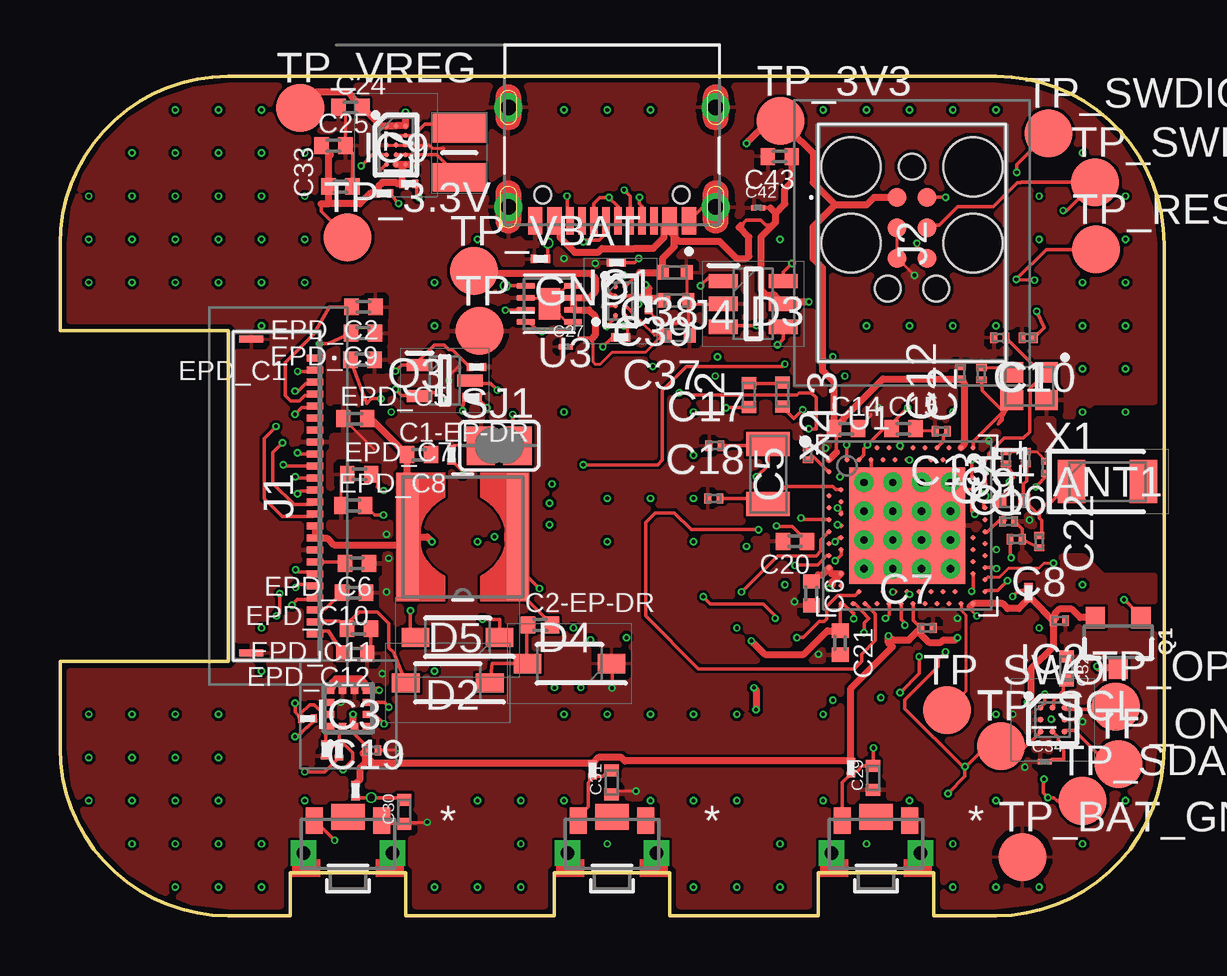
[diagram p2: board, top side]
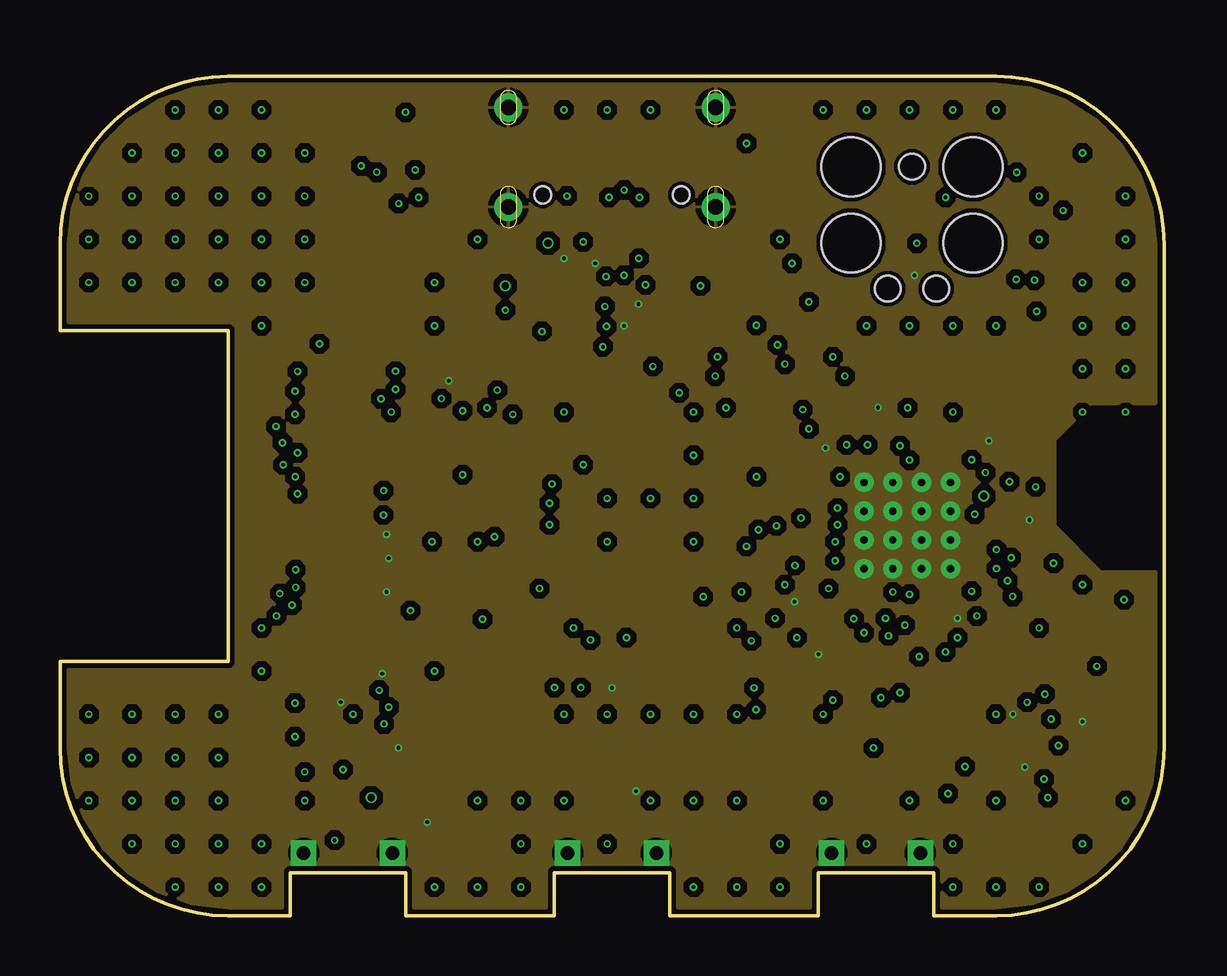
[diagram p3: board, inner layer Route2]
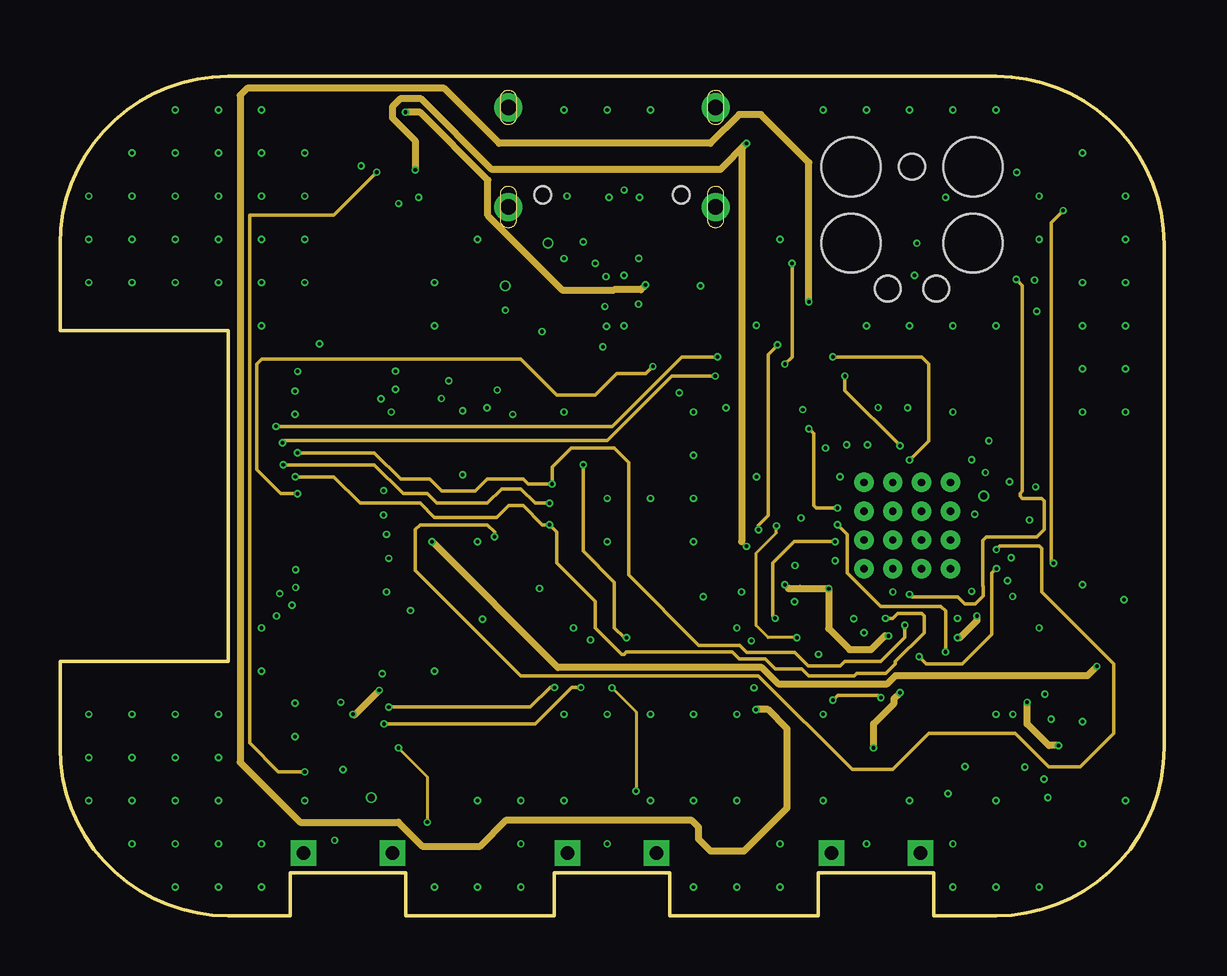
[diagram p4: board, inner layer Route63]
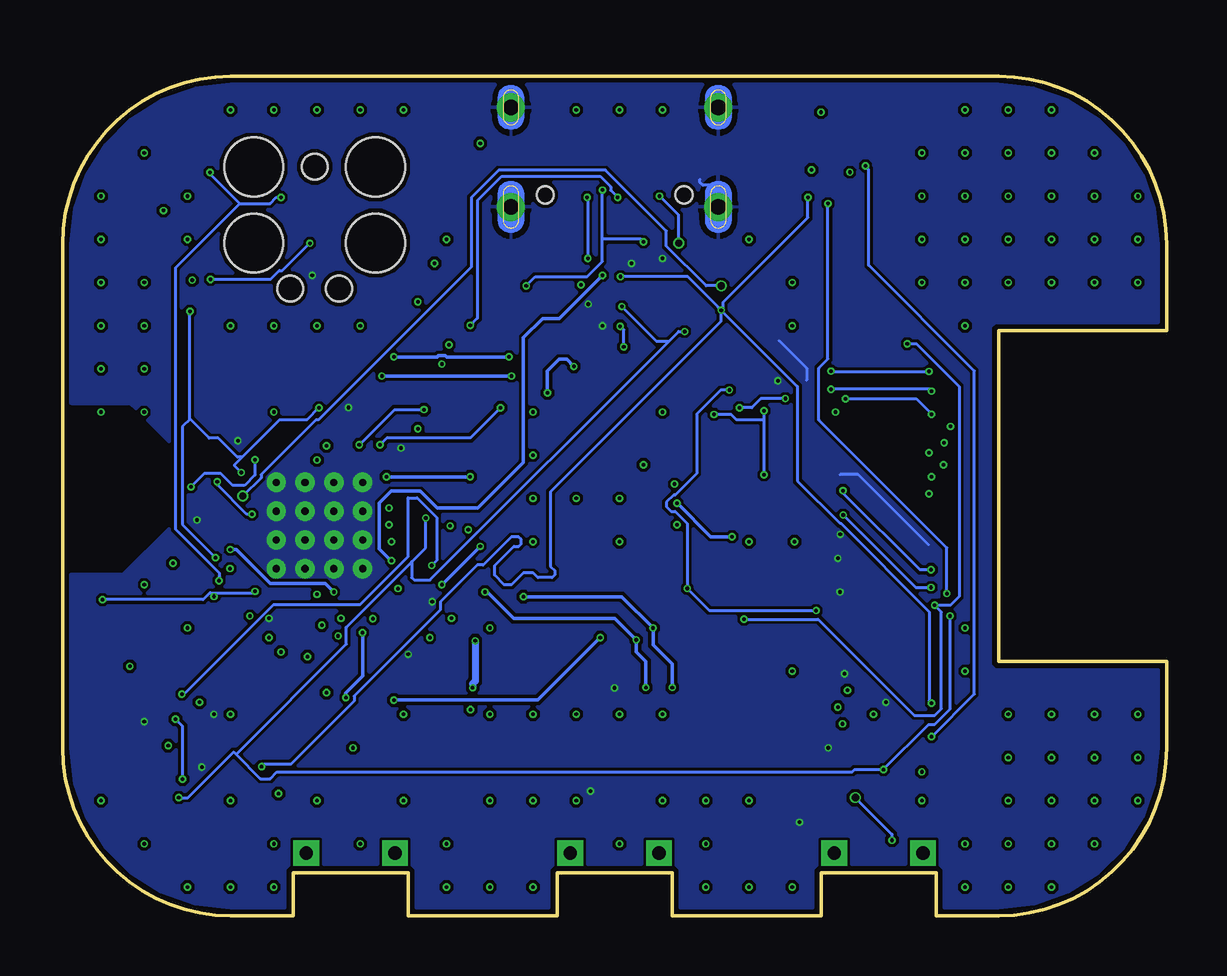
[diagram p5: board, bottom side, seen from below]

Size 46 x 35 mm. Coordinates in mm from the lower left corner, seen from the top.
Outline: 39,0 36.4,0 36.4,1.8 31.6,1.8 31.6,0 25.4,0 25.4,1.8 20.6,1.8 20.6,0 14.4,0 14.4,1.8 9.6,1.8 9.6,0 7,0 arc-90 0,7 0,10.6 7,10.6 7,24.4 0,24.4 0,28 arc-90 7,35 39,35 arc-90 46,28 46,7 arc-90 39,0
Copper layers (1+2*15+16): Top / Route2 / Route63 / Bottom
Stack-up 4 Layer Stack: Top SilkScreen Epoxy Ink / Top SolderMask SR:Green 0.0254mm Dk 4.3 / Top Surface Finish Lead-Free 0.02mm / Top CuFoil:007 0.035mm / Dielectric-1 Prepreg:003 0.061mm / Dielectric-2 Prepreg:003 0.061mm / Route2 CuFoil:007 0.035mm / Dielectric-3 Core:070 0.533mm / Route63 CuFoil:007 0.035mm / Dielectric-4 Prepreg:003 0.061mm / Dielectric-5 Prepreg:003 0.061mm / Bottom CuFoil:007 0.035mm / Bottom Surface Finish Lead-Free 0.02mm / Bottom SolderMask SR:Green 0.0254mm Dk 4.3 / Bottom SilkScreen Epoxy Ink
Design rules: minimum copper width 5mil, minimum drill size 0.15mm, copper clearance wire_polygon to wire_polygon 5mil, copper clearance wire_polygon to pad_smd 5mil, copper clearance wire_polygon to via 5mil, copper clearance pad_smd to pad_smd 5mil, copper clearance pad_smd to via 5mil, copper clearance via to via 5mil, copper clearance smd to pad (same net) 5mil, copper clearance smd to via (same net) 5mil, copper clearance smd to smd (same net) 5mil, dimension clearance 0.2mm, via restrict clearance 0mil, restrict clearance 0mil, drill distance 6mil, keepout clearance 0mil
RestrictTop: area 41.5,15.1 to 48.6,20.7

### Footprints (pad centres in the part's own frame; a part is rotated, then mirrored left to right if it is on the bottom)
2450AT18B100E_ANTC3216X140N = smd 1.15 x 1.8: 1 -1.5,0; 2 1.5,0
NORDIC_NRF_3_RESC0201_L = smd 0.28 x 0.43: 1 -0.255,0; 2 0.255,0
PERFECT_0402_0402 = smd 0.6 x 0.7: 1 -0.5,0; 2 0.5,0
GRM011R60J152KE01L_1_0201 = smd 0.35 x 0.25: 1 0,0.275; 2 0,-0.275
GRM011R60J152KE01L_2_CAPC0201X13N = smd 0.22 x 0.23: 1 -0.185,0; 2 0.185,0
NORDIC_NRF_3_RESC0402_L = smd 0.5 x 0.6: 1 -0.5,0; 2 0.5,0
ESP32_C6_LIBRARY_5_SOD3716X135N = smd 1.15 x 0.8: 1 -1.75,0; 2 1.75,0
ESP32_C6_LIBRARY_3_SOT95P280X145-6N = smd 1.2 x 0.6: 1 -1.25,0.95; 2 -1.25,0; 3 -1.25,-0.95; 4 1.25,-0.95; 5 1.25,0; 6 1.25,0.95
BQ25180YBGR_BGA8C40P2X4_100X155X50 = smd 0.2 x 0.2: A1 -0.2,0.6; A2 0.2,0.6; B1 -0.2,0.2; B2 0.2,0.2; C1 -0.2,-0.2; C2 0.2,-0.2; D1 -0.2,-0.6; D2 0.2,-0.6
DRV2605YZFR_BGA9C50P3X3_144X144X62 = smd 0.25 x 0.25: A1 -0.5,0.5; A2 0,0.5; A3 0.5,0.5; B1 -0.5,0; B2 0,0; B3 0.5,0; C1 -0.5,-0.5; C2 0,-0.5; C3 0.5,-0.5
BMA423_BMA423 = smd 0.3 x 0.35: 1 -0.75,-0.775; 2 -0.25,-0.775; 3 0.25,-0.775; 4 0.75,-0.775; 7 0.75,0.775; 8 0.25,0.775; 9 -0.25,0.775; 10 -0.75,0.775 | smd 0.35 x 0.3: 5 0.775,-0.25; 6 0.775,0.25; 11 -0.775,0.25; 12 -0.775,-0.25
RT6160AWSC_BGA15C40P3X5_140X230X60 = smd 0.216 x 0.216: A1 -0.4,0.8; A2 0,0.8; A3 0.4,0.8; B1 -0.4,0.4; B2 0,0.4; B3 0.4,0.4; C1 -0.4,0; C2 0,0; C3 0.4,0; D1 -0.4,-0.4; D2 0,-0.4; D3 0.4,-0.4; E1 -0.4,-0.8; E2 0,-0.8; E3 0.4,-0.8
503480-2400_5034802400 = smd 0.3 x 0.7: 1 -5.75,1.525; 2 -5.25,1.525; 3 -4.75,1.525; 4 -4.25,1.525; 5 -3.75,1.525; 6 -3.25,1.525; 7 -2.75,1.525; 8 -2.25,1.525; 9 -1.75,1.525; 10 -1.25,1.525; 11 -0.75,1.525; 12 -0.25,1.525; 13 0.25,1.525; 14 0.75,1.525; 15 1.25,1.525; 16 1.75,1.525; 17 2.25,1.525; 18 2.75,1.525; 19 3.25,1.525; 20 3.75,1.525; 21 4.25,1.525; 22 4.75,1.525; 23 5.25,1.525; 24 5.75,1.525 | smd 0.3 x 1: MP1 -6.54,-1.125; MP2 6.54,-1.125
TC2030-IDC_TC2030IDC = smd 0.783 x 0.783: 1 -0.953,-0.635; 2 -0.953,0.635; 3 0.317,-0.635; 4 0.317,0.635; 5 1.588,-0.635; 6 1.588,0.635 | hole 2.451: -2.223,-2.54; -2.223,2.54; 0.952,-2.54; 0.952,2.54 | hole 1.067: -2.223,0; 2.857,-1.016; 2.857,1.016
KH-TYPE-C-16P_KINGHELM_KH-TYPE-C-16P = smd 0.6 x 1.15: A1_B12 -3.2,4.725; A4_B9 -2.4,4.725; A9_B4 2.4,4.725; A12_B1 3.2,4.725 | smd 0.3 x 1.15: A5 -1.25,4.725; A6 -0.25,4.725; A7 0.25,4.725; A8 1.25,4.725; B5 1.75,4.725; B6 0.75,4.725; B7 -0.75,4.725; B8 -1.75,4.725 | drill 0.65 pad 1.05: SH1 -4.32,0; SH2 4.32,0; SH3 -4.32,4.15; SH4 4.32,4.15 | hole 0.7: -2.89,3.65; 2.89,3.65
NORDIC_NRF_2_RESC0402_L = smd 0.5 x 0.6: 1 -0.5,0; 2 0.5,0
ESP32_C6_LIBRARY_2_IND_4828-WE-TPC_WRE = smd 0.9 x 5.3: 1 -2.286,0; 2 2.286,0
MLP2016SR47MT0S1_INDC2016X100N = smd 1.2 x 2.2: 1 -1.028,0; 2 1.028,0
ESP32_C6_LIBRARY_4_ESP32_C6_LIBRARY_4_ESP32_C6_LIBRARY_4_ESP32_C6_LIBRARY_4_ESP32_WROVER_SPARKFUN-DISCRETESEMI_SOT23-3 = smd 0.8 x 0.9: 1 -0.95,-1; 2 0.95,-1; 3 0,1.1
ESP32_C6_LIBRARY_6_SOT65P210X110-3N = smd 1.05 x 0.5: 1 -1.05,0.65; 2 -1.05,-0.65; 3 1.05,0
ERA-1AEB3401C_0201 = smd 0.35 x 0.25: 1 0,0.275; 2 0,-0.275
CPF0201D7K68C1_0201 = smd 0.35 x 0.25: 1 0,0.275; 2 0,-0.275
ESP32_C6_LIBRARY_7_JUMPER_SJ = smd 1.168 x 1.6: 1 -0.762,0; 2 0.762,0
2025-10-22_07-23-44_LIBRARY_SW_EVP-AKE31A_PAN = smd 0.711 x 1.092: 1 -1.4,-0.972; 2 1.4,-0.972 | drill 0.559 pad 0.914 square: 3 -1.848,0.381; 4 1.848,0.381 | smd 1.397 x 1.092: 5 0,-1.124
HECTOR_WATCH_1_TP20R = smd 2 x 2: TP 0,0
NORDIC_NRF_4_AQFN50P700X700X85_HS-74N = smd 4.85 x 4.85: P$74 0,0 | drill 0.3 pad 0.6: P$75 -1.8,1.8; P$76 -0.6,1.8; P$77 0.6,1.8; P$78 1.8,1.8; P$79 -1.8,0.6; P$80 -0.6,0.6; P$81 0.6,0.6; P$82 1.8,0.6; P$83 -1.8,-0.6; P$84 -0.6,-0.6; P$85 0.6,-0.6; P$86 1.8,-0.6; P$87 -1.8,-1.8; P$88 -0.6,-1.8; P$89 0.6,-1.8; P$90 1.8,-1.8 | smd 0.2 x 0.2: P$A8 -1.25,3.25; P$A10 -0.75,3.25; P$A12 -0.25,3.25; P$A14 0.25,3.25; P$A16 0.75,3.25; P$A18 1.25,3.25; P$A20 1.75,3.25; P$A22 2.25,3.25; P$A23 2.75,3.25; P$AA24 3.25,-2.25; P$AB2 -2.75,-2.5; P$AC5 -2,-2.75; P$AC9 -1,-2.75; P$AC11 -0.5,-2.75; P$AC13 0,-2.75; P$AC15 0.5,-2.75; P$AC17 1,-2.75; P$AC19 1.5,-2.75; P$AC21 2,-2.75; P$AC24 3.25,-2.75; P$AD2 -2.75,-3.25; P$AD4 -2.25,-3.25; P$AD6 -1.75,-3.25; P$AD8 -1.25,-3.25; P$AD10 -0.75,-3.25; P$AD12 -0.25,-3.25; P$AD14 0.25,-3.25; P$AD16 0.75,-3.25; P$AD18 1.25,-3.25; P$AD20 1.75,-3.25; P$AD22 2.25,-3.25; P$AD23 2.75,-3.25; P$B1 -3.25,2.75; P$B3 -2.5,2.75; P$B5 -2,2.75; P$B7 -1.5,2.75; P$B9 -1,2.75; P$B11 -0.5,2.75; P$B13 0,2.75; P$B15 0.5,2.75; P$B17 1,2.75; P$B19 1.5,2.75; P$B24 3.25,2.75; P$C1 -3.25,2.25; P$D2 -2.75,2; P$D23 2.75,2; P$E24 3.25,1.75; P$F2 -2.75,1.5; P$F23 2.75,1.5; P$G1 -3.25,1.25; P$H2 -2.75,1; P$H23 2.75,1; P$J1 -3.25,0.75; P$J24 3.25,0.75; P$K2 -2.75,0.5; P$L1 -3.25,0.25; P$L24 3.25,0.25; P$M2 -2.75,0; P$N1 -3.25,-0.25; P$N24 3.25,-0.25; P$P2 -2.75,-0.5; P$P23 2.75,-0.5; P$R1 -3.25,-0.75; P$R24 3.25,-0.75; P$T2 -2.75,-1; P$T23 2.75,-1; P$U1 -3.25,-1.25; P$U24 3.25,-1.25; P$V23 2.75,-1.5; P$W1 -3.25,-1.75; P$W24 3.25,-1.75; P$Y2 -2.75,-2; P$Y23 2.75,-2
ESP32_C6_LIBRARY_SON50P200X200X80-9N = smd 0.76 x 0.27: 1 -0.985,0.75; 2 -0.985,0.25; 3 -0.985,-0.25; 4 -0.985,-0.75; 5 0.985,-0.75; 6 0.985,-0.25; 7 0.985,0.25; 8 0.985,0.75 | smd 0.9 x 1.3: 9 0,0
NORDIC_NRF_BT-XTAL_2016_N = smd 0.95 x 0.85: 1 -0.725,-0.575; 2 0.725,-0.575; 3 0.725,0.575; 4 -0.725,0.575
NORDIC_NRF_1_XTAL_3215_N = smd 1 x 1.8: 1 -1.25,0; 2 1.25,0

### Placement (x,y rotation side)
ANT1  43.65,18.1 0 top
C1  39.16,24.1 180 top
C1-EP-DR  14.95,19.23 0 top
C2  38.39,22.6 90 top
C2-EP-DR  20,12.13 0 top
C3  39.42,19.1 90 top
C4  40.24,19.1 90 top
C5  31.16,19.27 90 top
C6  31.31,13.44 270 top
C7  36.13,12 0 top
C8  41.64,12.3 0 top
C9  39.52,16.44 0 top
C10  40.34,24.1 180 top
C11  41.1,18.69 90 top
C12  37.52,22.64 90 top
C13  36.72,20.2 180 top
C14  32.75,20.31 0 top
C15  35.14,20.31 0 top
C16  39.84,15.7 0 top
C17  27.29,19.6 0 top
C18  27.24,17.4 0 top
C19  12.99,6.9 0 top
C20  30.63,15.61 180 top
C21  32.51,11.38 270 top
C22  40.8,15.6 270 top
C23  24.53,25.48 180 top
C24  12.1,33.71 0 top
C25  11.39,32.11 0 top
C27  21.07,23.72 0 top
C29  33.88,5.75 90 top
C30  14.35,4.34 90 top
C31  22.98,5.57 90 top
C32  41.93,10.32 270 top
C33  11.68,30.41 0 top
C34  41.03,6.42 0 top
C37  25.73,24.2 180 top
C38  25.61,26.82 180 top
C39  25.68,25.65 180 top
C42  29.09,29.52 0 top
C43  29.99,31.65 180 top
D2  16.16,9.71 180 top
D3  28.89,25.51 0 top
D4  21.23,10.51 180 top
D5  16.57,11.61 180 top
EPD_C1  12.6,23.18 180 top
EPD_C2  12.65,25.38 180 top
EPD_C5  12.3,20.73 0 top
EPD_C6  12.38,14.69 180 top
EPD_C7  12.47,18.41 0 top
EPD_C8  12.22,17.11 0 top
EPD_C9  12.63,24.29 180 top
EPD_C10  12.25,13.47 180 top
EPD_C11  12.45,11.97 180 top
EPD_C12  12.3,10.93 180 top
IC1  23.35,25.63 0 top
IC2  41.36,8.17 0 top
IC3  12.02,8.65 0 top
IC9  14,32.13 0 top
J1  9.1,17.5 270 top
J2  35.5,29 270 top
J4  23,33.7 180 top
L1  39.67,17.3 0 top
L2  28.7,21.72 90 top
L3  30.1,21.73 270 top
L5  16.78,15.8 180 top
L7  16.64,31.81 270 top
Q1  44.09,11.43 180 top
Q3  16.03,22.32 0 top
R1_EP_DR  17.17,21.62 90 top
R1_USB  23.18,27.23 90 top
R2  11.63,6.88 0 top
R2_EP_DR  17.35,22.88 270 top
R2_USB  20.02,27.39 270 top
R3  11.06,6.92 178.5 top
R4  10.31,8.22 92.2 top
R5  12.31,5.22 180 top
R7  32.95,6.18 180 top
R8  22.19,6.08 180 top
R9  23.37,24.12 270 top
R17  14.53,30.52 90 top
R18  13.49,30.12 90 top
R_PWR_EPD  40.35,13.48 0 top
R_TYPE_SEL  16.31,19.22 0 top
SJ1  18.3,19.6 0 top
SW_DN  34,3 180 top
SW_ENT  23,3 180 top
SW_UP  12,3 180 top
TP_3.3V  11.98,28.28 0 top
TP_3V3  30.03,33.13 0 top
TP_BAT_GND  40.1,2.45 0 top
TP_GND  17.47,24.38 0 top
TP_ON  44.11,6.33 0 top
TP_OP  43.99,8.73 0 top
TP_RESET  43.17,27.78 0 top
TP_SCL  39.2,7.08 0 top
TP_SDA  42.6,4.79 0 top
TP_SWDCLK  43.13,30.58 0 top
TP_SWDIO  41.19,32.62 0 top
TP_SWO  36.96,8.58 0 top
TP_VBAT  17.25,26.88 0 top
TP_VREG  10.01,33.68 0 top
U1  35.3,16.27 0 top
U3  20.39,25.51 180 top
X1  40.38,22.08 180 top
X2  29.5,18.41 270 top

### Tracks (layer width: path | path; a pad name or v marks a point on that pad's centre or on a via)
3V3  (via drill 0.15 pad 0.3)
  Top 0.127: v38.2,12.5 37.93,12.77 37.93,12.9
  Top 0.15: C14.1 32.35,20.21 32.35,19.32 | 12.73,7.11 12.27,7.57 IC3.3 | C34.2 41.31,6.52 41.82,6.52 41.82,6.88 v41.6,7.1 41.6,7.43 IC2.C2 | U1.P$AD14 35.55,12.32 C7.1
  Top 0.152: TP_3.3V.TP 10.88,29.38 10.88,29.68
  Top 0.3: U1.P$A22 37.67,19.64 37.67,22.23 C12.1 34.28,22.38 32.67,20.77 32.67,20.73 C14.1 32.25,22.24 31.77,22.72 31.77,27.01 31.38,27.39 31.38,28.73 32.31,29.65 | 32.35,19.32 U1.P$B1 | C6.1 31.59,14.22 31.75,14.22 U1.P$W1 32.05,14.37 32.15,14.27 U1.P$Y2 32.43,14.15 32.39,14.15 32.17,13.93 32.17,13.79 v32.03,13.64 | C8.1 41.48,12.39 41.48,12.63 41.64,12.79 42.15,12.79 42.51,12.43 Q1.2 | C8.1 40.48,13.21 R_PWR_EPD.2 39.95,12.81 39.49,12.81 39.28,13.02 U1.P$AD23 37.93,12.9 | C19.1 12.62,6.78 13.04,6.36 R8.2 22.43,6.6 23.39,6.6 23.54,6.46 R7.2 32.95,9.49 34.68,11.22 34.52,11.38 v34.52,11.67 34.69,11.5 35.37,11.5 C7.1 35.87,11.73 36.2,11.4 36.7,11.4 36.8,11.5 37.3,11.5 v37.4,11.6 | R5.2 12.51,5.7 12.51,6.18 12.73,6.4 C19.1 | 10.88,29.68 11.18,29.68 | 11.18,29.68 C33.1 11.18,31.82 C25.1 11.28,31.72 | IC9.E3 14.26,31.19 R17.1 14.06,30.52 14.01,30.57 13.43,30.57 13.26,30.41 13.26,30.17 R18.1 12.93,30.12 12.49,29.68 11.18,29.68 | 32.31,29.65 31.38,30.57 31.38,31.8 30.91,32.28 30.88,32.28 TP_3V3.TP 29.53,33.13 v28.6,32.2 | 32.31,29.65 33.61,29.65 33.92,29.95 J2.1 | C8.1 41.39,11.22 40.46,10.29 40.46,9.06 v40.3,8.9 | 12.73,7.11 C19.1 | IC3.10 11.34,9.5 11.34,9.71 11.5,9.88 12.53,9.88 12.7,9.71 12.7,9.5 IC3.7 13.28,9.43 v13.3,9.4 | IC3.3 12.21,7.93 v12.21,8.4 | IC9.E2 IC9.E3 | IC9.E3 14.57,31.33 v14.8,31.1
  Route63 0.127: v30.2,13.8 30.36,13.64 | 28.4,15.6 v28.6,15.4
  Route63 0.3: v41.6,7.1 41.2,7.1 40.3,8 v40.3,8.9 | v13.3,9.4 12.26,8.36 v12.21,8.4 | v14.8,31.1 14.8,32.31 13.85,33.27 13.85,33.73 14.17,34.05 15.05,34.05 17.99,31.11 27.51,31.11 v28.6,32.2 28.4,32 28.4,15.6 | v34.52,11.67 34.37,11.67 33.8,11.1 32.9,11.1 32.03,11.97 v32.03,13.64 30.84,13.64 30.83,13.65 30.37,13.65 30.36,13.64 | v38.2,12.5 38.2,12.3 37.5,11.6 v37.4,11.6
  Bottom 0.15: v28.6,15.4 v30.2,13.8
ALERT  (via drill 0.3)
  Top 0.15: v38.49,17.5 38.49,16.99 U1.P$J24 | v18.55,26.26 19.32,26.26 U3.5
  Bottom 0.127: v38.49,17.5 37.73,18.26 37.73,18.39 35.45,20.68 35.34,20.68 28.97,27.05 28.97,29.95 27.83,31.09 23.38,31.09 20.84,28.55 20.84,27.91 19.19,26.26 v18.55,26.26
D+  (via drill 0.15 pad 0.3)
  Top 0.15: D3.4 30.14,24.04 v29.9,23.8 | v29.1,16.1 26.3,16.1 25.6,16.8 24.8,16.8 24.4,16.4 24.4,12.5 26.6,10.3 33.1,10.3 33.4,10.6 33.4,10.9 33.98,11.48 33.98,12.59 U1.P$AD6
  Route63 0.15: v29.9,23.8 29.5,23.4 29.5,16.68 29.1,16.28 v29.1,16.1
D-  (via drill 0.15 pad 0.3)
  Top 0.15: D3.6 30.14,26.84 v30.5,27.2 | v30.2,23 30.1,22.9 26.1,22.9 25.1,21.9 25.1,19 24.9,18.8 v21.8,18.8 | v33.5,11.8 33.5,12.2 33.7,12.4 33.12,13.02 U1.P$AD4
  Route63 0.15: v30.5,27.2 30.5,23.3 v30.2,23 | v21.8,18.8 21.8,15.2 23.1,13.9 23.1,12 23.5,11.6 v23.6,11.6 | v34.2,9.09 34.1,9.2 32.4,9.2 v32.2,8.99
  Bottom 0.15: v23.6,11.6 26.2,9 v32.19,9 v32.2,8.99 | v33.5,11.8 33.5,10 34.2,9.3 v34.2,9.09
DEC1
  Top 0.15: U1.P$C1 32.02,18.52 31.38,19.15 31.26,19.15 31.13,19.02 C5.1
DEC3  (via drill 0.15 pad 0.3)
  Top 0.15: v40.65,17.88 41.16,18.39 C11.1 | U1.P$D23 37.99,18.26 v37.99,19.02
  Bottom 0.127: v37.99,19.02 37.99,18.37 38.41,17.94 38.92,17.94 39.42,18.44 40.09,18.44 v40.65,17.88
DEC4_6  (via drill 0.15 pad 0.3)
  Top 0.15: U1.P$B5 33.49,19.21 33.49,19.48 v33.64,19.63 34.3,20.29 34.56,20.29 C15.1 34.56,20.42 v35.32,21.18 | C10.1 41.02,24.52 v40.7,25.2 | v30.95,21.1 30.57,20.73 30.11,21.18 L3.2 | U1.P$E24 v38.55,18.48 | C16.1 39.59,14.98 v39.63,14.93
  Bottom 0.127: 38.52,19.12 36.97,20.68 35.83,20.68 v35.32,21.18 | 38.52,19.12 38.82,18.82 38.82,18.75 v38.55,18.48 | 40.69,20.71 41.02,20.39 41.02,16.32 v39.63,14.93 | v40.7,25.2 40.7,20.72 40.69,20.71 | 40.69,20.71 39.89,19.91 39.51,19.91 38.72,19.12 38.52,19.12 | v30.95,21.1 32.17,21.1 v33.64,19.63
DN  (via drill 0.15 pad 0.3)
  Top 0.15: v26.68,26.26 27.06,26.64 27.45,26.64 27.57,26.52 D3.1 | J4.B7 23.76,29.06 23.76,30 v23.51,30.26 | J4.A7 22.75,28.46 22.46,28.18 21.88,28.18 v21.8,28.09
  Bottom 0.127: v26.68,26.26 26.3,26.64 24.14,26.64 23.51,27.28 23.51,28.2 | 23.51,28.2 v23.51,30.26 | v21.8,28.09 21.91,28.2 23.51,28.2
DP  (via drill 0.15 pad 0.3)
  Top 0.15: 22.87,29.95 22.49,29.95 22.24,29.69 22.24,29.06 J4.B6 | 22.87,29.95 23.25,29.56 23.25,29.06 J4.A6 | v29.02,24.61 27.7,24.61 D3.3 | 22.87,29.95 v22.87,29.95
  Bottom 0.127: v29.02,24.61 28.71,24.91 28.71,29.82 27.7,30.84 23.61,30.84 23.17,30.4 23.17,30.25 v22.87,29.95
EPD_3V3  (via drill 0.15 pad 0.3)
  Top 0.3: Q1.3 43.27,10.33 v43.2,10.4 | v15.5,15.6 15.3,15.8 L5.2 14.45,15.84 | J1.15 J1.16 11.13,15.75 11.41,15.46 14.07,15.46 14.45,15.84 | 14.45,15.84 C1-EP-DR.1 12.95,20.73 EPD_C5.2
  Route63 0.3: v43.2,10.4 42.81,10.01 34.81,10.01 34.45,9.65 29.95,9.65 29.25,10.35 20.75,10.35 v15.5,15.6
EPD_BUSY  (via drill 0.15 pad 0.3)
  Top 0.15: J1.9 9.95,19.25 v9.9,19.3 | U1.P$AD12 35.05,12.35 35.2,12.2 v35.2,12.12
  Route63 0.15: v9.9,19.3 13.1,19.3 14.2,18.2 15.4,18.2 15.9,17.7 17.3,17.7 17.8,18.2 19.3,18.2 19.5,18 v20.5,18 20.5,18.7 21.3,19.5 23.1,19.5 23.7,18.9 23.7,14.2 26.62,11.28 28.32,11.28 28.61,10.98 30.61,10.98 31.17,10.42 32.52,10.42 32.7,10.6 34.2,10.6 35.2,11.6 v35.2,12.12
EPD_CS  (via drill 0.15 pad 0.3)
  Top 0.15: J1.12 10.57,17.7 10,17.7 v9.9,17.6 | v25.8,21.8 26.2,21.8 26.3,21.7 30.7,21.7 30.8,21.8 31.3,21.8 31.5,21.6 31.5,20.3 v31.2,20.3 | U1.P$K2 32.55,16.85 v32.4,17
  Route63 0.15: v9.9,17.6 9.2,17.6 8.2,18.6 8.2,23 8.4,23.2 19.2,23.2 20.7,21.7 22.3,21.7 23.2,22.6 24.4,22.6 v24.7,22.9 | v31.2,20.3 31.4,20.1 31.4,17.1 31.5,17 v32.4,17
  Bottom 0.15: v24.7,22.9 25,23.2 25.3,23.2 25.8,22.7 v25.8,21.8
EPD_DC  (via drill 0.15 pad 0.3)
  Top 0.15: J1.11 9.85,18.25 v9.8,18.3 | U1.P$AD10 34.55,12.55 v34.4,12.4
  Route63 0.15: v9.8,18.3 11.4,18.3 12.5,17.2 15,17.2 15.6,16.6 18.2,16.6 18.7,17.1 19.3,17.1 20.1,16.3 v20.4,16.3 20.7,16 20.7,14.7 22.3,13.1 22.3,12 23.4,10.9 23.5,10.9 23.6,11 28,11 28.3,10.7 29.39,10.7 29.8,10.3 30.9,10.3 31.2,10 33.1,10 33.2,10.1 34.4,10.1 34.8,10.5 34.8,10.6 36,11.8 36,12.5 35.9,12.6 34.9,12.6 34.7,12.4 v34.4,12.4
EPD_RST  (via drill 0.15 pad 0.3)
  Top 0.15: J1.10 9.35,18.75 v9.3,18.8 | U1.P$AC11 34.78,13.5 v34.7,13.5
  Route63 0.15: v9.3,18.8 13.1,18.8 14.3,17.6 15.3,17.6 15.7,17.2 17.8,17.2 18.4,17.8 19.2,17.8 19.8,17.2 v20.4,17.2 | v18.11,15.8 18.11,15.99 17.8,16.3 15,16.3 14.8,16.1 14.8,14.4 19.2,10 29.1,10 33,6.1 34.7,6.1 36.2,7.6 39.8,7.6 41.2,6.2 42.5,6.2 43.9,7.6 43.9,10.5 40.9,13.5 40.9,15.31 40.8,15.41 39.16,15.41 v39.01,15.27
  Bottom 0.15: v34.7,13.5 35.06,13.86 37.35,13.86 38.76,15.27 v39.01,15.27 | v18.11,15.8 19,15.8 v20.4,17.2
GDR  (via drill 0.15 pad 0.3)
  Top 0.15: v13.98,22.71 14.24,22.96 14.87,22.96 Q3.1 15,22.96 15,23.2 15.6,23.8 16,23.8 16.2,23.6 16.35,23.6 R2_EP_DR.2 | J1.2 10.57,22.69 v9.9,22.69
  Bottom 0.127: v13.98,22.71 13.97,22.69 v9.9,22.69
GND  (via drill 0.15 pad 0.3)
  Top 0.127: D4.1 23,10.49 v23,9.5 | C31.1 23.11,5.2 v24,5.2 | C24.1 11.89,33.42 C25.2 12.18,31.82 C33.2 | IC9.C1 IC9.C2 IC9.C3 15.37,32.13 15.5,32 16,32 | SW_UP.1 13.53,3.85 C30.1 14.4,3.9 v15.3,3.9 | C2.2 39.45,22.86 X1.2 | C13.2 35.75,20.2 C15.2 | C3.2 C4.2 40.69,19.36 C11.2 | C16.2 C22.2 | v14.1,7 14,6.9 C19.2 | 13.08,19.45 EPD_C5.1 | 20.44,25.56 U3.9 20.8,25.1 20.8,25.07 21.11,24.76 U3.1 21.02,24.4 20.8,24.4 | 20.44,25.56 20.8,25.93 20.8,25.95 21.11,26.26 U3.4 | U3.6 20.24,25.76 20.44,25.56 | C38.1 26.11,25.72 C39.1 | C39.1 26.18,24.7 | 26.18,24.7 26.18,24.25 C37.1 | 11.72,16.9 EPD_C8.1 11.72,18.16 EPD_C7.1 | 16.62,22.92 16.2,22.5 v16.2,22.3 | J2.3 J2.5 34.89,27.41 v35.6,26.7 | R_TYPE_SEL.1 16.41,19.6 SJ1.1 | U1.P$F23 37.4,17.77 U1.P$78 | C14.2 33.8,20.86 33.8,20.9 | U1.P$75 33.8,18.37 U1.P$B7 33.8,17.77 U1.P$74 | C23.1 25.04,24.7 26.18,24.7 | R9.1 23.64,24.93 IC1.D2 23.55,24.65 v23.5,24.6 | C39.1 26.32,25.51 D3.2
  Top 0.15: J4.A1_B12 26.77,29.55 J4.SH3 | EPD_C11.1 12.95,11.08 EPD_C12.1 | C9.2 40.09,16.12 C16.2
  Route63 0.127: v23,9.5 24,8.5 v24,5.2 | v14.1,7 15.3,5.8 v15.3,3.9
  Bottom 0.127: 13.6,18.39 12.84,18.39 9.92,15.47 | 18.55,33.63 J4.SH2 | 34.68,18.14 U1.P$76 | 19.44,30.71 19.44,30.58 19.32,30.45 18.71,30.45 18.68,30.48 | 15,22.33 15,22.83 16.14,23.98
  other vias: 11.7,8.9 13.6,15.9 13.7,14.9 40.4,16.5 38.7,19.8 22.3,27.2 21,27.4 42.6,8.1 24.1,25.5 39.7,8.4 34.09,21.19 30.6,13.1 31.9,19.5 31.6,10.9 40.2,6.2 37.4,12.4 13.61,13.5 13.43,10.1
  pour Route2: -2.5,37.3 41.8,37.3 47.8,31.3 47.8,21.3 43,21.3 41.5,19.8 41.5,16.3 43.4,14.4 49.2,14.4 49.2,-3.3 -0.1,-3.3 -1.1,-2.3 -1.1,35.9
  pour Bottom: -2.1,36.9 44.1,36.9 48.3,32.7 48.3,21.3 43.2,21.3 41.5,19.6 41.5,16.3 43.5,14.3 49.2,14.3 49.2,-3.3 -0.3,-3.3 -0.4,-3.2 -0.6,-3.2 -1.8,-2 -1.8,36.6
  pour Top: -5.1,38.9 49.3,38.9 51.2,37 51.2,21.3 43.1,21.3 41.4,19.6 41.4,16.4 43.5,14.3 51.2,14.3 51.2,-1.8 50.8,-2.2 -4.9,-2.2 -4.9,38.7
HAPTIC_EN  (via drill 0.15 pad 0.3)
  Top 0.15: v30.62,14.61 30.65,14.61 30.67,14.63 31.56,14.63 31.95,15.02 U1.P$U1 | v41.03,9.24 41.03,8.86 40.91,8.74 IC2.A1
  Bottom 0.127: v41.03,9.24 40.93,9.24 37.2,12.97 33.6,12.97 31.6,14.97 31.6,17.42 31.23,17.42 30.42,16.62 30.42,14.81 v30.62,14.61
IMU_INT1  (via drill 0.15 pad 0.3)
  Top 0.15: IC3.5 13.1,8.4 v13.5,8 | v28.4,13.5 29.9,15 31.5,15 31.7,15.2 31.7,15.67 U1.P$N1
  Route63 0.15: v13.5,8 19.8,8 21.32,9.52 v21.7,9.52
  Bottom 0.15: v28.4,13.5 28.3,13.5 27.2,12.4 23,12.4 v22.1,11.5 22.1,11 21.7,10.6 v21.7,9.52
IMU_INT2  (via drill 0.15 pad 0.3)
  Top 0.15: IC3.6 13.5,8.9 v13.7,8.7 | v26.8,13.3 27.1,13 29.3,13 29.8,12.5 v29.8,12.4 | U1.P$P2 32.47,15.77 v32.3,15.6
  Route63 0.15: v13.7,8.7 19.6,8.7 20.42,9.52 v20.6,9.52 | v29.8,12.4 29.7,12.5 29.7,14.7 30.6,15.6 v32.3,15.6
  Bottom 0.15: v26.8,13.3 22.7,13.3 v21.4,12 21.4,11.3 20.6,10.5 v20.6,9.52
LX1
  Top 0.15: L7.1 16.48,33 15.2,33 14.73,32.53 IC9.B3 IC9.B2
LX2
  Top 0.15: IC9.D2 IC9.D3 15.69,31.73 L7.2
MOSI  (via drill 0.15 pad 0.3)
  Top 0.15: U1.P$B13 35.38,19.02 v35.4,19 | v9,20.4 8.5,19.9 8.5,17.4 9.25,16.65 10.53,16.65 J1.14
  Route63 0.15: v35.4,19 36.2,19.8 36.2,23 35.9,23.3 v32.2,23.3 | v27.4,23.3 25.9,23.3 23,20.4 v9,20.4
  Bottom 0.15: v32.2,23.3 30.4,23.3 30.35,23.35 30.05,23.35 30,23.3 v27.4,23.3
N$1
  Top 0.15: C4.1 40.27,18.79 40.27,18.14 40.14,18.01 40.14,17.37 L1.2 40.27,17.25 40.27,17.22 40.8,16.7 | 40.8,16.7 40.8,16.6 40.91,16.48 40.91,15.96 C22.1 | 40.8,16.7 40.8,16.87 41.17,17.25 41.3,17.25 ANT1.1
N$2  (via drill 0.15 pad 0.3)
  Top 0.15: v9.79,7.47 9.89,7.47 10.27,7.85 10.3,7.85 10.61,8.16 R4.2 | IC9.D1 13.01,31.72 v12.55,31.26
  Bottom 0.127: v9.79,7.47 8.01,9.24 8.01,22.72 12.41,27.12 12.41,31.13 v12.55,31.26
N$3  (via drill 0.15 pad 0.3)
  Top 0.15: v22.62,23.72 23,24.1 R9.2 | IC1.D1 23.15,24.95 v22.77,24.57
  Bottom 0.127: v22.62,23.72 22.62,24.42 v22.77,24.57
N$4
  Top 0.15: 39.48,21.2 38.05,19.77 U1.P$A23 | 39.48,21.2 39.09,20.51 39.26,20.68 39.26,21.06 38.42,21.89 C2.1 | 39.48,21.2 X1.3
N$5  (via drill 0.15 pad 0.3)
  Top 0.15: IC9.E1 13.27,31 v13.2,31 | R2.2 11.02,6 v10.2,6
  Route63 0.15: v13.2,31 11.4,29.2 7.9,29.2 7.9,7.2 9.1,6 v10.2,6
N$6  (via drill 0.15 pad 0.3)
  Top 0.15: v24.14,29.95 24.14,29.69 24.27,29.56 24.27,29.06 J4.A5 | v24.12,27.41 23.94,27.23 R1_USB.2
  Bottom 0.127: v24.12,27.41 24.12,29.92 v24.14,29.95
N$7
  Top 0.15: L2.2 28.71,22.2 29.86,22.2 29.98,22.07 30.11,22.2 L3.1
N$8
  Top 0.15: R3.2 11.07,7.55 11.32,7.76 11.32,7.85 IC3.1
N$9
  Top 0.15: C1.1 40.86,22.65 X1.1 40.58,22.13 40.54,22.13 40.43,22.01 40.43,21.31 40.4,21.28 40.4,20.17 40.14,19.91 39.34,19.91 38.7,19.28 38.7,19.17 U1.P$B24
N$10  (via drill 0.15 pad 0.3)
  Top 0.15: v38.11,16.74 37.99,16.86 37.99,17.25 U1.P$H23 | C3.1 39.71,18.39 39.71,18.25 v39.56,18.1 39.56,17.69 L1.1
  Bottom 0.127: v38.11,16.74 38.32,16.74 39.56,17.98 v39.56,18.1
N$11
  Top 0.15: IC2.A2 41.41,8.74 41.41,8.99 41.8,9.37 41.8,9.75 41.92,9.88 C32.2
N$12  (via drill 0.15 pad 0.3)
  other vias: 39,33.6 37.2,33.6 35.4,33.6 33.6,33.6 31.8,33.6 24.6,33.6 22.8,33.6 21,33.6 8.4,33.6 6.6,33.6 4.8,33.6 42.6,31.8 10.2,31.8 8.4,31.8 6.6,31.8 4.8,31.8 3,31.8 44.4,30 40.8,30 10.2,30 8.4,30 6.6,30 4.8,30 3,30 1.2,30 44.4,28.2 40.8,28.2 30,28.2 17.4,28.2 10.2,28.2 8.4,28.2 6.6,28.2 4.8,28.2 3,28.2 1.2,28.2 44.4,26.4 42.6,26.4 15.6,26.4 10.2,26.4 8.4,26.4 6.6,26.4 4.8,26.4 3,26.4 1.2,26.4 44.4,24.6 42.6,24.6 39,24.6 37.2,24.6 35.4,24.6 33.6,24.6 15.6,24.6 8.4,24.6 44.4,22.8 42.6,22.8 44.4,21 42.6,21 37.2,21 26.4,21 21,21 13.8,21 26.4,19.2 26.4,17.4 24.6,17.4 22.8,17.4 26.4,15.6 22.8,15.6 17.4,15.6 42.6,13.8 40.8,12 28.2,12 8.4,12 15.6,10.2 8.4,10.2 39,8.4 31.8,8.4 28.2,8.4 26.4,8.4 24.6,8.4 22.8,8.4 21,8.4 6.6,8.4 4.8,8.4 3,8.4 1.2,8.4 28.2,1.2 26.4,1.2 19.2,1.2 17.4,1.2 15.6,1.2 8.4,1.2 6.6,1.2 4.8,1.2 30,1.2 37.2,1.2 39,1.2 40.8,1.2 3,3 4.8,3 6.6,3 8.4,3 19.2,3 22.8,3 30,3 33.6,3 37.2,3 42.6,3 1.2,4.8 3,4.8 4.8,4.8 6.6,4.8 10.2,4.8 17.4,4.8 19.2,4.8 21,4.8 24.6,4.8 26.4,4.8 28.2,4.8 31.8,4.8 35.4,4.8 39,4.8 44.4,4.8 1.2,6.6 3,6.6 4.8,6.6 6.6,6.6
N$13
  Top 0.15: 19.44,10.52 19.44,12.04 C2-EP-DR.1 | 19.44,10.52 18.01,10.52 D2.1 | 19.44,10.52 D4.2
N$14
  Top 0.15: U1.P$N24 38.62,15.98 39.26,16.61 39.38,16.48 C9.1
N$15  (via drill 0.15 pad 0.3)
  Top 0.15: v16.78,18.39 16.78,18.52 16.4,18.9 R_TYPE_SEL.2 | v16.78,21.06 16.78,21.25 R1_EP_DR.1 | v18.86,20.9 18.86,19.86 19.06,19.66 SJ1.2
  Bottom 0.127: v16.78,21.06 16.78,20.68 | 16.78,20.68 v16.78,18.39 | v18.86,20.9 18.15,20.9 17.92,20.68 16.78,20.68
N$16  (via drill 0.15 pad 0.3)
  Top 0.15: C2-EP-DR.2 20.46,12.17 19.19,13.44 19.19,15.72 L5.1 19.06,14.56 v19.97,13.65 | v18.22,21.92 17.94,22.2 17.16,22.2 Q3.3 | D5.2 14.6,11.83 v14.6,12.73
  Bottom 0.127: v18.22,21.92 18.58,21.92 19.57,20.93 19.57,18.45 20.48,17.54 20.54,17.54 20.84,17.24 20.84,17.06 20.64,16.86 20.48,16.86 19.97,16.36 v19.97,13.65 19.06,12.73 v14.6,12.73
N$17
  Top 0.15: EPD_C2.2 11.22,25.38 10.58,24.26 9.38,23.05 9.38,21.7 9.62,21.45 9.97,21.45 10.2,21.69 10.57,21.69 J1.4
N$18  (via drill 0.15 pad 0.3)
  Top 0.15: v13.38,21.56 12.97,21.56 12.78,21.36 EPD_C1.2 | J1.5 10.55,21.18 10.07,21.18 v9.79,20.91
  Bottom 0.127: v13.38,21.56 10.44,21.56 v9.79,20.91
N$20  (via drill 0.15 pad 0.3)
  Top 0.15: U1.P$AC5 33.14,13.36 32.41,13.36 31.94,12.89 31.94,12.37 31.84,12.27 31.63,12.27 30.97,11.6 v30.7,11.6 | v29.85,16.25 29.88,16.23 30.51,16.23 C20.1
  Route63 0.127: v30.7,11.6 29.5,11.6 29,12.1 29,15.12 29.85,15.97 v29.85,16.25
N$22  (via drill 0.15 pad 0.3)
  Top 0.15: v32.78,19.63 32.78,19.02 U1.P$B3 | v27.75,21.18 28.46,21.18 28.59,21.06 28.71,21.18 L2.1
  Bottom 0.127: v32.78,19.63 32.48,19.93 29,19.93 v27.75,21.18
N$26  (via drill 0.15 pad 0.3, 0.3)
  Top 0.15: v20.33,28.04 20.33,27.41 R2_USB.1 | J4.B5 21.13,29.1 v21.13,30
  Bottom 0.127: v20.33,28.04 20.33,29.21 v21.13,30
N$30
  Top 0.15: J1.18 11.82,14.75 EPD_C6.2
N$31  (via drill 0.15 pad 0.3)
  Top 0.127: EPD_C7.2 13.22,18.16 13.22,17.88
  Top 0.15: 13.22,17.88 13.38,17.73 v13.48,17.73 | v9.82,14.43 9.92,14.32 10.28,14.32 10.3,14.31 10.57,14.31 J1.19
  Bottom 0.127: v9.82,14.43 10.27,14.43 13.48,17.64 v13.48,17.73
N$32  (via drill 0.15 pad 0.3)
  Top 0.127: EPD_C8.2 13.12,16.71
  Top 0.15: v9.82,13.69 9.95,13.82 10.55,13.82 J1.20 | 13.12,16.71 v13.47,16.71
  Bottom 0.127: v9.82,13.69 10.45,13.69 v13.47,16.71
N$34
  Top 0.15: J1.22 10.68,12.8 11.06,12.8 11.73,13.47 EPD_C10.2
N$35
  Top 0.15: C13.1 36.81,20.03 36.81,19.78 U1.P$A18
N$37
  Top 0.15: J1.24 10.84,11.88 11.17,11.88 EPD_C12.2
OUT+
  Top 0.15: IC2.A3 41.92,8.61 42.81,8.61 42.94,8.74 43.95,8.74 TP_OP.TP
OUT-
  Top 0.15: IC2.C3 41.92,7.72 42.27,7.72 43.54,6.45 44.08,6.45 TP_ON.TP
P0.00/XL1  (via drill 0.15 pad 0.3)
  Top 0.15: C17.2 29.44,19.6 X2.1 29.5,18.78 v29.02,18.3 | U1.P$D2 32.53,18.27 v32.5,18.3
  Bottom 0.15: v29.02,18.3 v32.5,18.3
P0.01/XL2
  Top 0.15: U1.P$F2 32.33,17.77 32.21,17.9 30.24,17.9 X2.2 29.26,17.4 C18.2
P0.13  (via drill 0.15 pad 0.3, 0.3)
  Top 0.15: R5.1 12.33,4.93 v12.97,4.93 14.24,4.93 C30.2 | v11.44,3.15 10.68,3.91 SW_UP.2
  Bottom 0.127: v11.44,3.15 11.44,3.4 v12.97,4.93
P0.14
  Top 0.15: C31.2 22.87,6.07 22.62,5.82 22.24,5.82 R8.1 22.01,5.54 22.01,4.55 21.61,4.14 SW_ENT.2
P1.01  (via drill 0.15 pad 0.3)
  Top 0.15: R_PWR_EPD.1 40.27,13.69 40.14,13.56 39.95,13.56 v39.7,13.31 | v44.34,13.18 44.97,12.55 Q1.1 | U1.P$Y23 38.05,13.59 v37.99,13.53
  Bottom 0.127: v44.34,13.18 40.14,13.18 39.86,13.46 39.84,13.46 | 39.84,13.46 38.05,13.46 v37.99,13.53 | v39.7,13.31 39.84,13.46
P1.02  (via drill 0.15 pad 0.3)
  Top 0.15: SW_DN.2 32.6,5.55 R7.1 33.07,6.03 33.22,6.03 33.44,6.25 C29.2 33.88,6.98 v33.9,7 | v35.8,10.8 35.8,10.1 v35,9.3 | v39.02,14.48 38.98,14.52 U1.P$W24
  Route63 0.15: v35.8,10.8 36.1,10.5 37.6,10.5 38.83,11.73 38.83,14.28 v39.02,14.48
  Route63 0.3: v35,9.3 34.76,9.05 34.76,8.86 33.9,8.01 v33.9,7
PMIC_INT  (via drill 0.15 pad 0.3)
  Top 0.15: IC1.A1 23.15,26.33 23.5,26.68 v23.5,26.7 | U1.P$T2 32.55,15.05 v32.3,14.8
  Bottom 0.15: v23.5,26.7 25.3,24.9 26,24.9 26.8,24.1 26.8,18.9 28.7,17 30.4,17 31.1,17.7 32.3,17.7 32.8,17.2 32.8,15.3 v32.3,14.8
PREVGH  (via drill 0.15 pad 0.3)
  Top 0.15: v9.66,12.96 9.89,13.18 10.55,13.18 J1.21 | v17.6,12.37 18.32,12.37 D5.1 | EPD_C9.2 11.18,23.85 v10.81,23.85
  Bottom 0.127: 9.66,12.95 v9.66,12.96 | v17.6,12.37 14.52,12.37 10.51,8.36 9.66,8.36 9.38,8.64 9.38,12.67 9.66,12.95 | v10.81,23.85 10.43,23.85 8.65,22.07 8.65,13.31 9.01,12.95 9.66,12.95
PREVGL
  Top 0.15: J1.23 10.68,12.29 11.63,12.29 11.86,12.06 | D2.2 13.9,10.98 13.7,11.18 13.7,12.19 13.22,12.67 12.46,12.67 11.86,12.07 11.86,12.06 | EPD_C11.2 11.86,12.06
RESE  (via drill 0.15 pad 0.3)
  Top 0.15: v15.89,21.56 15.63,21.82 15.13,21.82 15,21.69 Q3.2 14.87,21.69 14.24,21.69 v13.98,21.95 | R1_EP_DR.2 17.4,21.57 v17.79,21.18 | v9.79,21.87 9.92,21.87 10.25,22.2 10.57,22.2 J1.3
  Bottom 0.127: v17.79,21.18 17.29,21.18 16.9,21.56 v15.89,21.56 | v13.98,21.95 13.96,21.97 9.89,21.97 v9.79,21.87
RESET  (via drill 0.15 pad 0.3)
  Top 0.127: v40.6,26.5 39.88,26.5 v39.84,26.54
  Top 0.15: v35.7,28.04 35.7,27.91 36.08,27.53 J2.6 | TP_RESET.TP 41.09,27.78 v39.84,26.54 | v35.4,13.4 35.3,13.5 U1.P$AC13
  Route63 0.15: v35.4,13.4 35.5,13.3 37.4,13.3 37.7,13 38.14,13 38.47,13.33 38.47,13.72 38.44,13.75 38.44,15.64 38.6,15.8 40.7,15.8 41,16.1 41,17.3 40.9,17.4 40.1,17.4 40,17.5 40,17.6 40.1,17.7 40.1,26.28 v39.84,26.54
  Bottom 0.127: v35.7,28.04 36.84,26.9 36.97,26.9 37.33,26.54 v39.84,26.54
SCK  (via drill 0.15 pad 0.3)
  Top 0.15: U1.P$A12 35,19.57 v35,19.6 | v9.27,19.72 8.87,19.32 8.87,18.03 9.75,17.15 10.53,17.15 J1.13
  Route63 0.15: v35,19.6 32.7,21.9 v32.7,22.5 | v27.3,22.5 25.49,22.5 22.81,19.82 9.37,19.82 v9.27,19.72
  Bottom 0.15: v32.7,22.5 v27.3,22.5
SCL  (via drill 0.15 pad 0.3)
  Top 0.15: IC2.C1 40.78,7.59 40.14,6.96 39.26,6.96 TP_SCL.TP 39.13,6.96 38.49,6.96 37.76,6.22 v37.7,6.22 | v18.55,25.25 19.32,25.25 U3.7 | IC1.B1 23.13,25.88 23,25.88 22.75,26.14 22.75,26.52 22.75,26.53 v22.75,26.65 | v9.79,8.86 9.79,8.5 R4.1 10.04,8.44 10.4,8.8 10.6,8.8 11,8.4 IC3.12 | v14.95,29.95 14.87,30.02 14.87,30.45 R17.2 | v37.7,6.22 37.7,5.8 v37,5.1 | U1.P$M2 32.52,16.3 v32.4,16.3 | v37.7,6.22 37.61,6.22 35.2,8.63 35.2,9 36.6,10.4 36.6,10.7 v36.9,11
  Route63 0.15: v32.4,16.3 32.8,15.9 32.8,14.3 34.2,12.9 36.7,12.9 36.9,12.7 v36.9,11
  Bottom 0.127: v18.55,25.25 18.53,25.22 18.48,25.28 18.48,25.58 14.95,29.11 v14.95,29.95 | v9.79,8.86 9.89,8.96 9.89,12.68 13.59,16.37 13.62,16.37 15.38,18.13 15.38,22.07 18.53,25.22 | v18.55,25.25 18.68,25.37 19.95,26.64 v22.75,26.64 v22.75,26.65 | 18.53,25.22 v18.55,25.25 | 18.53,25.22 18.57,25.17 18.57,24.77 25.67,17.67 25.67,14.57 25.5,14.4 25.5,14.2 25.6,14.1 26.2,14.1 26.4,14.3 26.8,14.3 27.3,13.8 27.6,13.8 28,14.2 28,14.6 27.2,15.4 27,15.4 26.9,15.5 26.9,15.7 27,15.8 27.3,15.8 28.48,14.62 28.72,14.62 30.26,13.09 30.26,12.76 33.86,9.16 33.86,8.95 36.49,6.32 37.61,6.32 v37.7,6.22
SDA  (via drill 0.15 pad 0.3)
  Top 0.127: v22.7,25.4 22.73,25.43 IC1.C1 | IC2.B2 41.33,8.17 v41.3,8.2
  Top 0.15: TP_SDA.TP 42.56,4.8 41.54,4.8 41.41,4.93 v41.16,4.93 40.96,5.13 40.96,5.66 v41,5.7 | v14.11,29.69 13.99,29.81 R18.2 | v9.16,13.44 9.16,12.64 v9.02,12.5 | v20.08,24.36 19.95,24.36 19.57,24.74 19.44,24.74 U3.8 | IC3.2 11.63,7.73 R2.1 11.85,7.15 12.2,6.8 12.2,6.5 v11.8,6.1 | U1.P$L1 30.93,16.53 v30.87,16.58
  Bottom 0.127: v41.16,4.93 40.78,4.93 38.88,6.83 38.77,6.73 | 38.77,6.73 37.76,5.72 37.35,5.72 37.07,6 13.1,6 13,6.1 v11.8,6.1 9.92,7.97 9.66,7.97 9.02,8.62 v9.02,12.5 | v14.11,29.69 14.11,23.21 14.49,22.83 14.49,20.68 9.16,15.34 v9.16,13.44 | v20.08,24.36 20.33,24.36 20.75,23.95 | 20.75,23.95 30.69,14 31.35,14 31.45,14.11 31.45,14.76 | 31.45,14.76 34.19,12.03 34.18,12.01 34.18,11.33 38.77,6.73 | 20.75,23.95 21.25,23.95 v22.7,25.4 | v41,5.7 41,7.9 v41.3,8.2 | 31.45,14.76 30.87,15.34 v30.87,16.58
SWDCLK  (via drill 0.15 pad 0.3)
  Top 0.127: v41.4,14.7 41,14.7 40.8,14.5 39.53,14.5 39.16,14.14 38.67,14.14 U1.P$AA24
  Top 0.15: J2.4 36.21,28.8 36.64,28.8 37.41,29.56 38.88,29.56 39.88,30.57 40.04,30.57 40.05,30.58 TP_SWDCLK.TP 41.95,29.4 v41.8,29.4
  Route63 0.15: v41.4,14.7 41.3,14.8 41.3,28.9 v41.8,29.4
SWDIO  (via drill 0.15 pad 0.3)
  Top 0.15: v39.48,13.97 39.08,13.56 38.62,13.56 U1.P$AC24 | v39.86,30.99 39.86,31.32 41.16,32.61 TP_SWDIO.TP | J2.2 v36.9,29.95
  Bottom 0.127: 38.62,29.69 41.3,27.01 41.3,16.12 39.48,14.3 v39.48,13.97 | v39.86,30.99 39.86,30.94 38.62,29.69 | 38.62,29.69 37.36,29.69 37.1,29.95 v36.9,29.95
SWO
  Top 0.127: TP_SWO.TP 37.74,9.36 37.74,12.54 37.55,12.73 U1.P$AD22
VBAT
  Top 0.127: C27.2 21.64,24.1 22,24.1 | 22,24.1 22.2,24.1 | C37.2 25.1,24.2 | 25.1,24.2 24.78,24.2 24.29,24.69 | 22,24.1 22.2,23.9 22.2,23.1 22.3,23 22.5,23 23,23.5 24.4,23.5 25.1,24.2 | 25.1,24.2
  Top 0.15: IC1.C2 23.65,25.33 23.68,25.33 23.85,25.16 23.85,25.13 24.29,24.69
  Top 0.3: TP_VBAT.TP 17.35,26.78 22.12,26.78 22.3,26.6 22.3,26 22.06,25.76 U3.3 U3.2 22.04,25.26 22.3,25 22.3,24.2 22.2,24.1
VBUS  (via drill 0.15 pad 0.3)
  Top 0.15: IC1.A2 24.14,26.82 | 28.38,28.78 28.6,29 29.2,29 29.4,28.8 29.7,28.8 | C42.2 29.6,29.52 | C21.1 32.51,12.98 U1.P$AD2 32.62,13.02 33.02,12.62 33.07,12.62 v33.07,12.39
  Top 0.3: J4.A9_B4 20.82,28.75 20.82,28.29 21.44,27.67 22.42,27.67 22.57,27.82 23.93,27.82 23.94,27.83 24.73,27.83 25.18,28.29 25.18,28.75 | 25.18,28.75 J4.A4_B9 25.62,28.75 25.62,28.29 25.79,28.12 27.48,28.12 28.2,27.4 28.6,27.4 28.7,27.5 28.7,28.3 28.3,28.7 28.38,28.78 | 24.14,26.82 C38.2 25.11,27.41 25.6,27.9 25.6,28.33 25.18,28.75 | v31.2,25.6 30.23,25.6 D3.5 29.77,25.88 29.43,25.88 29.2,26.11 29.2,28.3 29.7,28.8 29.82,28.92 29.82,29.3 | 29.6,29.52 29.82,29.3 | 29.82,29.3 30.2,29.68 30.2,30.3 30.49,30.59 C43.1 | C21.1 31.97,11.88 30.99,10.9 29.37,10.9 v28.81,11.46 | v28.91,9.51 29,9.42 v29,8.6
  Route63 0.3: v31.2,25.6 31.2,31.4 29.2,33.4 28.3,33.4 27.1,32.2 18.3,32.2 16,34.5 7.8,34.5 7.5,34.2 7.5,6.4 10,3.9 14.1,3.9 15.1,2.9 17.5,2.9 18.6,4 26.3,4 26.6,3.7 26.6,3.2 27.1,2.7 28.5,2.7 30.3,4.5 30.3,7.8 29.5,8.6 v29,8.6
  Bottom 0.3: v28.81,11.46 28.81,9.79 28.91,9.69 v28.91,9.51
VREG  (via drill 0.15 pad 0.3)
  Top 0.15: 24.43,25.86 23.7,25.86 23.68,25.83 IC1.B2
  Top 0.3: C23.2 25.07,25.76 C39.2 | v14.4,33.5 IC9.A3 IC9.A2 IC9.A1 13.59,32.91 13.39,32.91 C24.2 12.18,34.13 12.18,34.17 12.02,34.34 10.67,34.34 TP_VREG.TP | v24.4,26.3 24.53,26.17 C23.2 | C23.2 24.43,25.86
  Route63 0.3: v14.4,33.5 15,33.5 17.82,30.68 17.82,29.2 20.93,26.09 23.09,26.09 23.09,26.1 24.2,26.1 v24.4,26.3